# Altium project Tiny817_Xplained_Pro.PrjPCB (part 1 of 2)
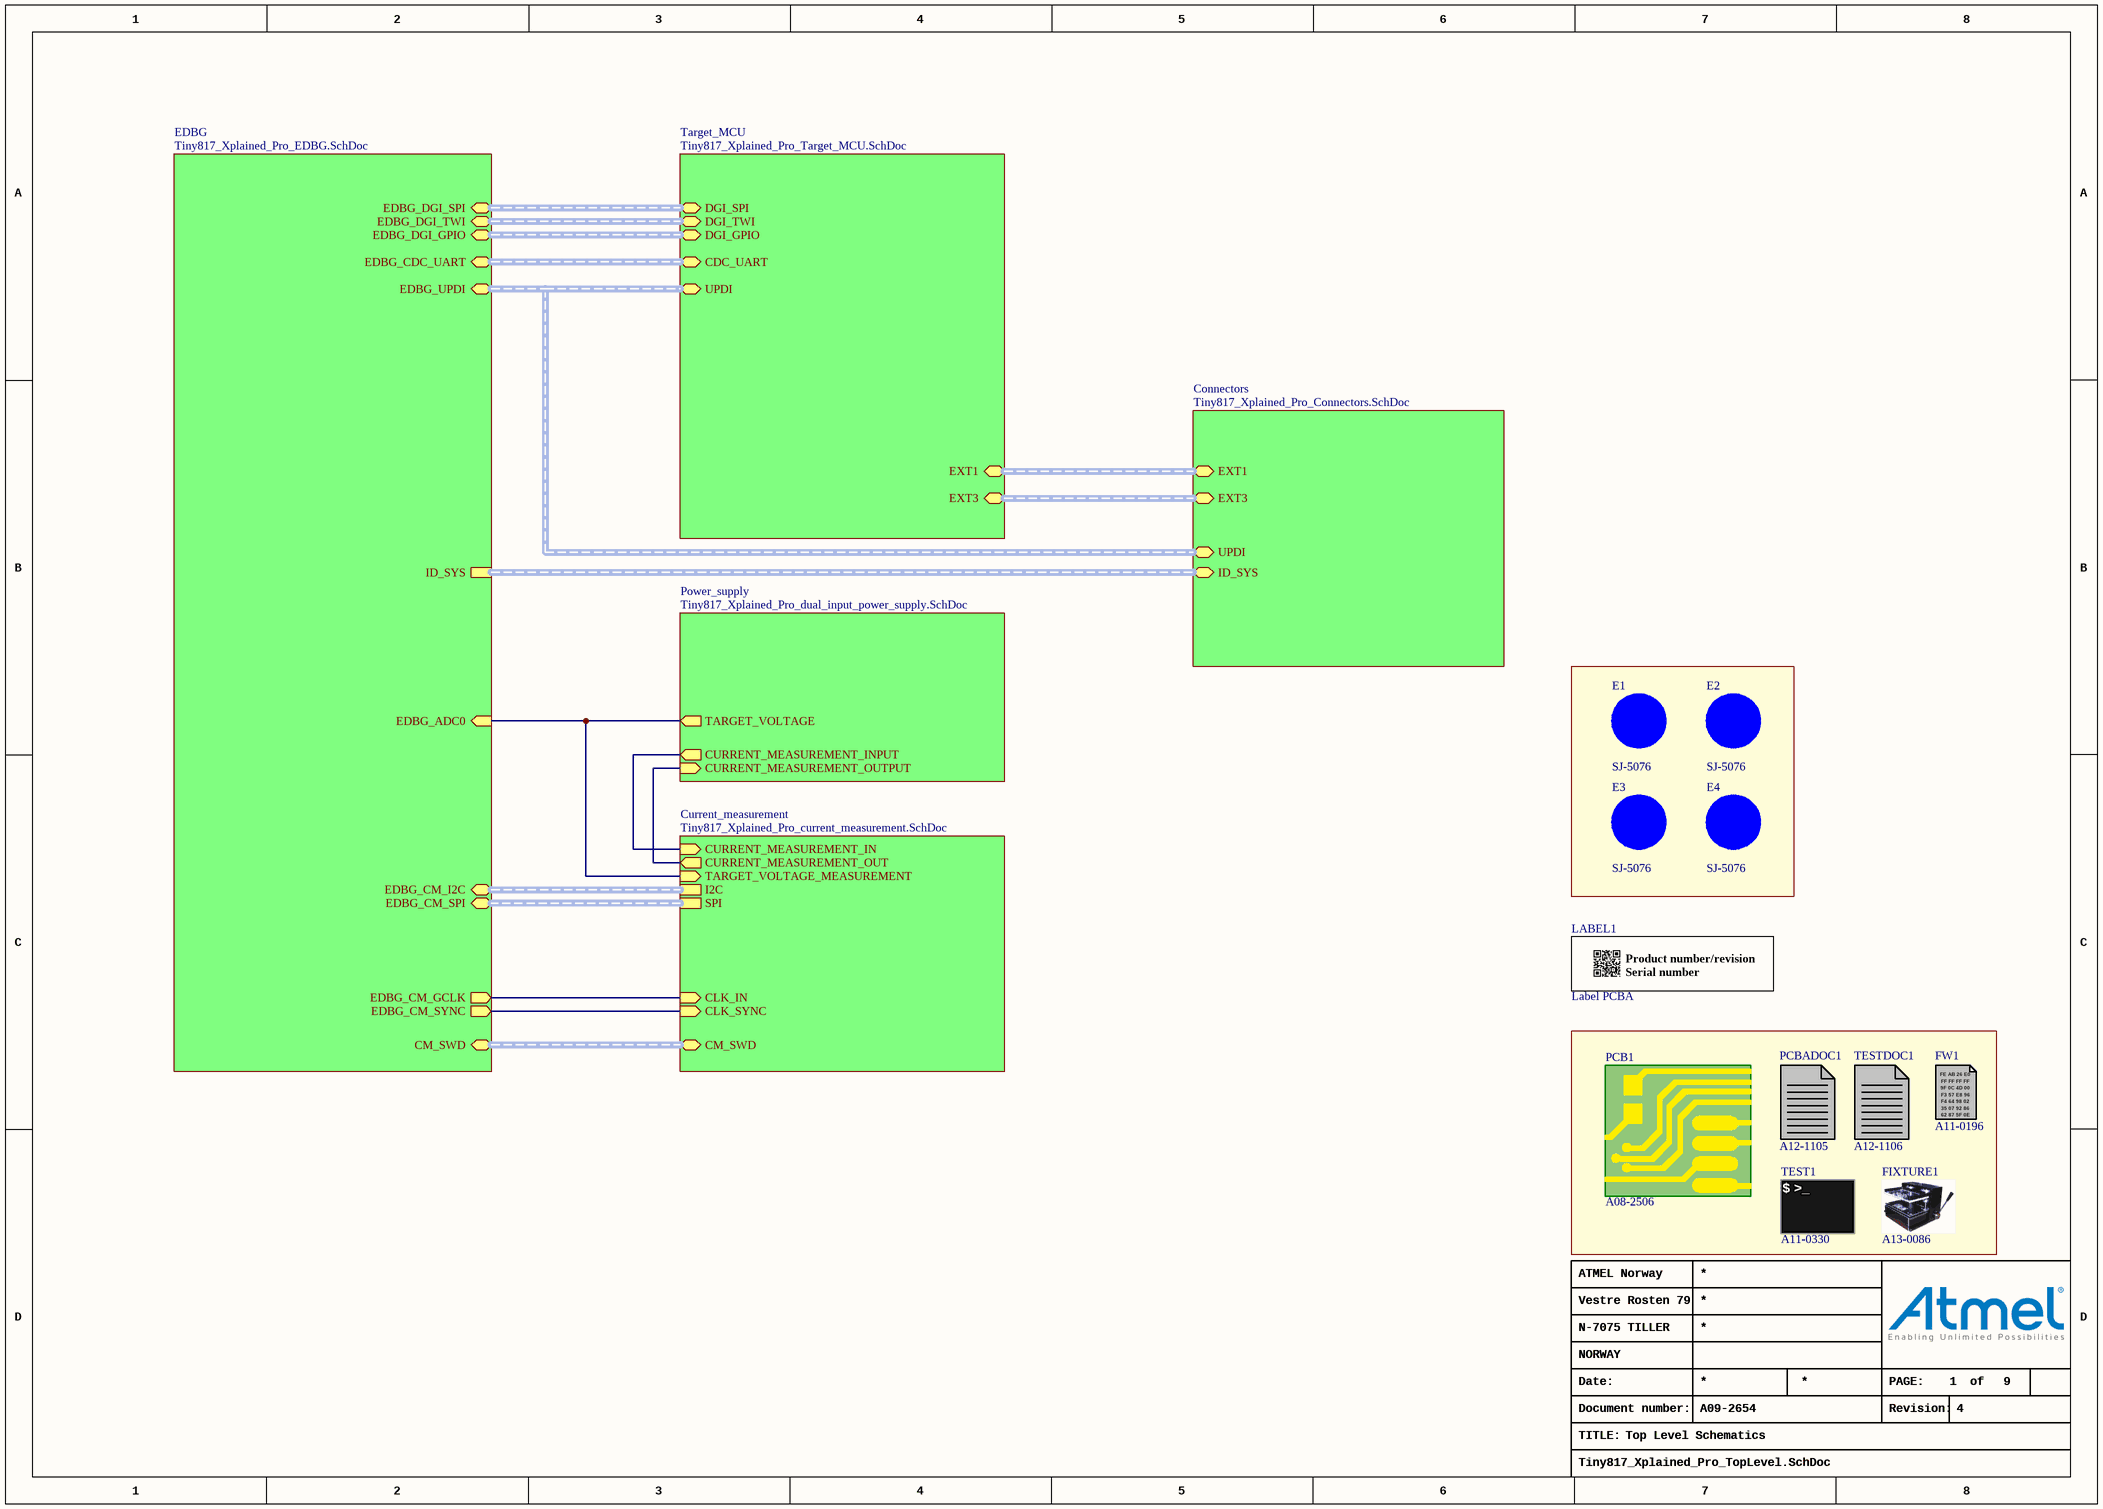
[diagram p0: Tiny817_Xplained_Pro_TopLevel.SchDoc]
9 sheets, 178 parts. Net scope: hierarchical (ports join the sheet entries above them; power ports are global).
Board file: Tiny817_Xplained_Pro.PcbDoc
Sheets:
  Tiny817_Xplained_Pro_TopLevel.SchDoc
    Target_MCU = Tiny817_Xplained_Pro_Target_MCU.SchDoc
    EDBG = Tiny817_Xplained_Pro_EDBG.SchDoc
    Connectors = Tiny817_Xplained_Pro_Connectors.SchDoc
    Power_supply = Tiny817_Xplained_Pro_dual_input_power_supply.SchDoc
    Current_measurement = Tiny817_Xplained_Pro_current_measurement.SchDoc
      Calibration = Tiny817_Xplained_Pro_current_measurement_calibration.SchDoc
      Control = Tiny817_Xplained_Pro_current_measurement_control.SchDoc
      Frontend = Tiny817_Xplained_Pro_current_measurement_frontend.SchDoc

## Sheet Tiny817_Xplained_Pro_TopLevel.SchDoc: Top Level Schematics
size A3; Organization: ATMEL Norway; Address1: Vestre Rosten 79; Address2: N-7075 TILLER; Address3: NORWAY; DocumentNumber: A09-2654; Revision: 4; SheetNumber: 1; SheetTotal: 9; PageSetup: Record=PageOptions|CenterHorizontal=True|CenterVertical=True|PrintScale=1.01|XCorrection=1.00|YCorrection=1.00|PrintKind=1|BorderSize=5000000|LeftOffset=0|BottomOffset=0|Orientation=2|PaperLength=1000|PaperWidth=1000|Scale=100|PaperSource=7|PrintQuality=-4|MediaType=1|DitherType=10|PaperKind=Letter|PrintScaleMode=1

### Parts
E1  value SJ-5076  [AP8-00192]
E2  value SJ-5076  [AP8-00192]
E3  value SJ-5076  [AP8-00192]
E4  value SJ-5076  [AP8-00192]
FIXTURE1  AN: A13-0086  (mechanical)
FW1  AN: A11-0196  (mechanical)
LABEL1  value Label PCBA  [AP8-00317]
PCB1  AN: A08-2506  (mechanical)
PCBADOC1  AN: A12-1105  (mechanical)
TEST1  AN: A11-0330  (mechanical)
TESTDOC1  AN: A12-1106  (mechanical)

### Sub-sheets
Connectors = Tiny817_Xplained_Pro_Connectors.SchDoc: EXT1 (harness EXT), EXT3 (harness EXT), UPDI (harness UPDI), ID_SYS (harness ID_SYS)
Current_measurement = Tiny817_Xplained_Pro_current_measurement.SchDoc: I2C (harness I2C), SPI (harness SPI), CLK_IN (in), CLK_SYNC (in), CURRENT_MEASUREMENT_OUT (out), CURRENT_MEASUREMENT_IN (in), TARGET_VOLTAGE_MEASUREMENT (in), CM_SWD (harness SWD)
EDBG = Tiny817_Xplained_Pro_EDBG.SchDoc: ID_SYS (harness ID_SYS), EDBG_CDC_UART (harness UART), EDBG_DGI_TWI (harness I2C), EDBG_DGI_SPI (harness SPI), EDBG_ADC0 (in), EDBG_CM_I2C (harness I2C), EDBG_CM_SPI (harness SPI), EDBG_CM_GCLK (out), EDBG_CM_SYNC (out), CM_SWD (harness SWD), EDBG_DGI_GPIO (harness GPIO), EDBG_UPDI (harness UPDI)
Power_supply = Tiny817_Xplained_Pro_dual_input_power_supply.SchDoc: TARGET_VOLTAGE (out), CURRENT_MEASUREMENT_INPUT (out), CURRENT_MEASUREMENT_OUTPUT (in)
Target_MCU = Tiny817_Xplained_Pro_Target_MCU.SchDoc: DGI_SPI (harness SPI), DGI_TWI (harness I2C), CDC_UART (harness UART), EXT3 (harness EXT), EXT1 (harness EXT), DGI_GPIO (harness GPIO), UPDI (harness UPDI)

### Nets
CM_PA09_AIN17: sheet EDBG/EDBG_ADC0, sheet Power_supply/TARGET_VOLTAGE, sheet Current_measurement/TARGET_VOLTAGE_MEASUREMENT
CM_PA11_GCLK5: sheet EDBG/EDBG_CM_SYNC, sheet Current_measurement/CLK_SYNC
CM_PA14_GCLK0: sheet EDBG/EDBG_CM_GCLK, sheet Current_measurement/CLK_IN
VCC_CM_IN_P3V3: sheet Power_supply/CURRENT_MEASUREMENT_INPUT, sheet Current_measurement/CURRENT_MEASUREMENT_IN
NetJ101_3: sheet Power_supply/CURRENT_MEASUREMENT_OUTPUT, sheet Current_measurement/CURRENT_MEASUREMENT_OUT

Not connected (* = marked no-connect by the designer): E1 1(FIDUCIAL); E2 1(FIDUCIAL); E3 1(FIDUCIAL); E4 1(FIDUCIAL)

### Buses and harness runs
harness sheet Connectors/EXT1 = sheet Target_MCU/EXT1
harness sheet Connectors/EXT3 = sheet Target_MCU/EXT3
harness sheet Connectors/ID_SYS = sheet EDBG/ID_SYS
harness sheet Connectors/UPDI = sheet EDBG/EDBG_UPDI = sheet Target_MCU/UPDI
harness sheet Current_measurement/CM_SWD = sheet EDBG/CM_SWD
harness sheet Current_measurement/I2C = sheet EDBG/EDBG_CM_I2C
harness sheet Current_measurement/SPI = sheet EDBG/EDBG_CM_SPI
harness sheet EDBG/EDBG_CDC_UART = sheet Target_MCU/CDC_UART
harness sheet EDBG/EDBG_DGI_GPIO = sheet Target_MCU/DGI_GPIO
harness sheet EDBG/EDBG_DGI_SPI = sheet Target_MCU/DGI_SPI
harness sheet EDBG/EDBG_DGI_TWI = sheet Target_MCU/DGI_TWI

### Notes on the sheet
- Date:
- PAGE:
- of
- TITLE:
- Document number:
- Revision:
- (in symbol A09-0611) / Product number/revision / Serial number
- (in symbol A11-0196) FE AB 26 E0; FF FF FF FF; 9F 0C 4D 00; F3 57 E8 96; F4 64 98 02; 35 07 92 86; 62 87 5F 0E
- (in symbol A11-0330) $ >_

### Library data of the parts
E1-E4 = A08-0053: 2.8mm adhesive feet,diam 8.0mm; PartGroup: Mechanical devices,Mounting accessories; Manufacturer: 3M; AN: A08-0053; Height: 2,79999995231628; MPN: SJ-5076
FIXTURE1 = A13-0086: Xplained PRO MCU board Jupiter Test Fixture; PartGroup: Test Equipment,Test Fixtures; Manufacturer: ESCATEC; Value: Xplained PRO MCU board Jupiter Test Fixture; MPN: Xplained PRO MCU board Jupiter Test Fixture
FW1 = A11-0196: EDBG secured firmware; PartGroup: Software,Firmware,Tools; Manufacturer: ATMEL; Value: EDBG secured firmware
LABEL1 = A09-0611: PCBA identification label PP Top White Gloss; PartGroup: Mechanical devices,Packaging materials,Printed Labels; Manufacturer: ACT Logimark AS; MPN: 505462; AN: A09-0611
PCB1 = A08-2506: ATtiny807 Xplained Pro PCB documentation; PartGroup: Mechanical devices,Printed circuit boards; Value: ATtiny817 Xplained Pro PCB documentation
PCBADOC1 = A12-1105: ATtiny807 Xplained Pro PCBA documentation; PartGroup: Documentation,PCBA Documents,Atmel; Value: A09-2654 PCBA Files
TEST1 = A11-0330: Fixture test for ATtiny807 Xplained Pro; PartGroup: Software,Test software,Starter Kit; Value: ATtiny817 Xplained Pro test
TESTDOC1 = A12-1106: ATtiny807 Xplained Pro Test Instructions; PartGroup: Documentation,Procedures,Test Instructions; Value: ATtiny817 Xplained Pro Test Instructions

## Sheet Tiny817_Xplained_Pro_Target_MCU.SchDoc: Target MCU
size A3; Organization: ATMEL Norway; Address1: Vestre Rosten 79; Address2: N-7075 TILLER; Address3: NORWAY; DocumentNumber: A09-2654; Revision: 4; SheetNumber: 2; SheetTotal: 9; PageSetup: Record=PageOptions|CenterHorizontal=True|CenterVertical=True|PrintScale=1.01|XCorrection=1.00|YCorrection=1.00|PrintKind=1|BorderSize=5000000|LeftOffset=0|BottomOffset=0|Orientation=2|PaperLength=1000|PaperWidth=1000|Scale=100|PaperSource=7|PrintQuality=-4|MediaType=1|DitherType=10|PaperKind=A3 (297 x 420 mm)|PrintScaleMode=1
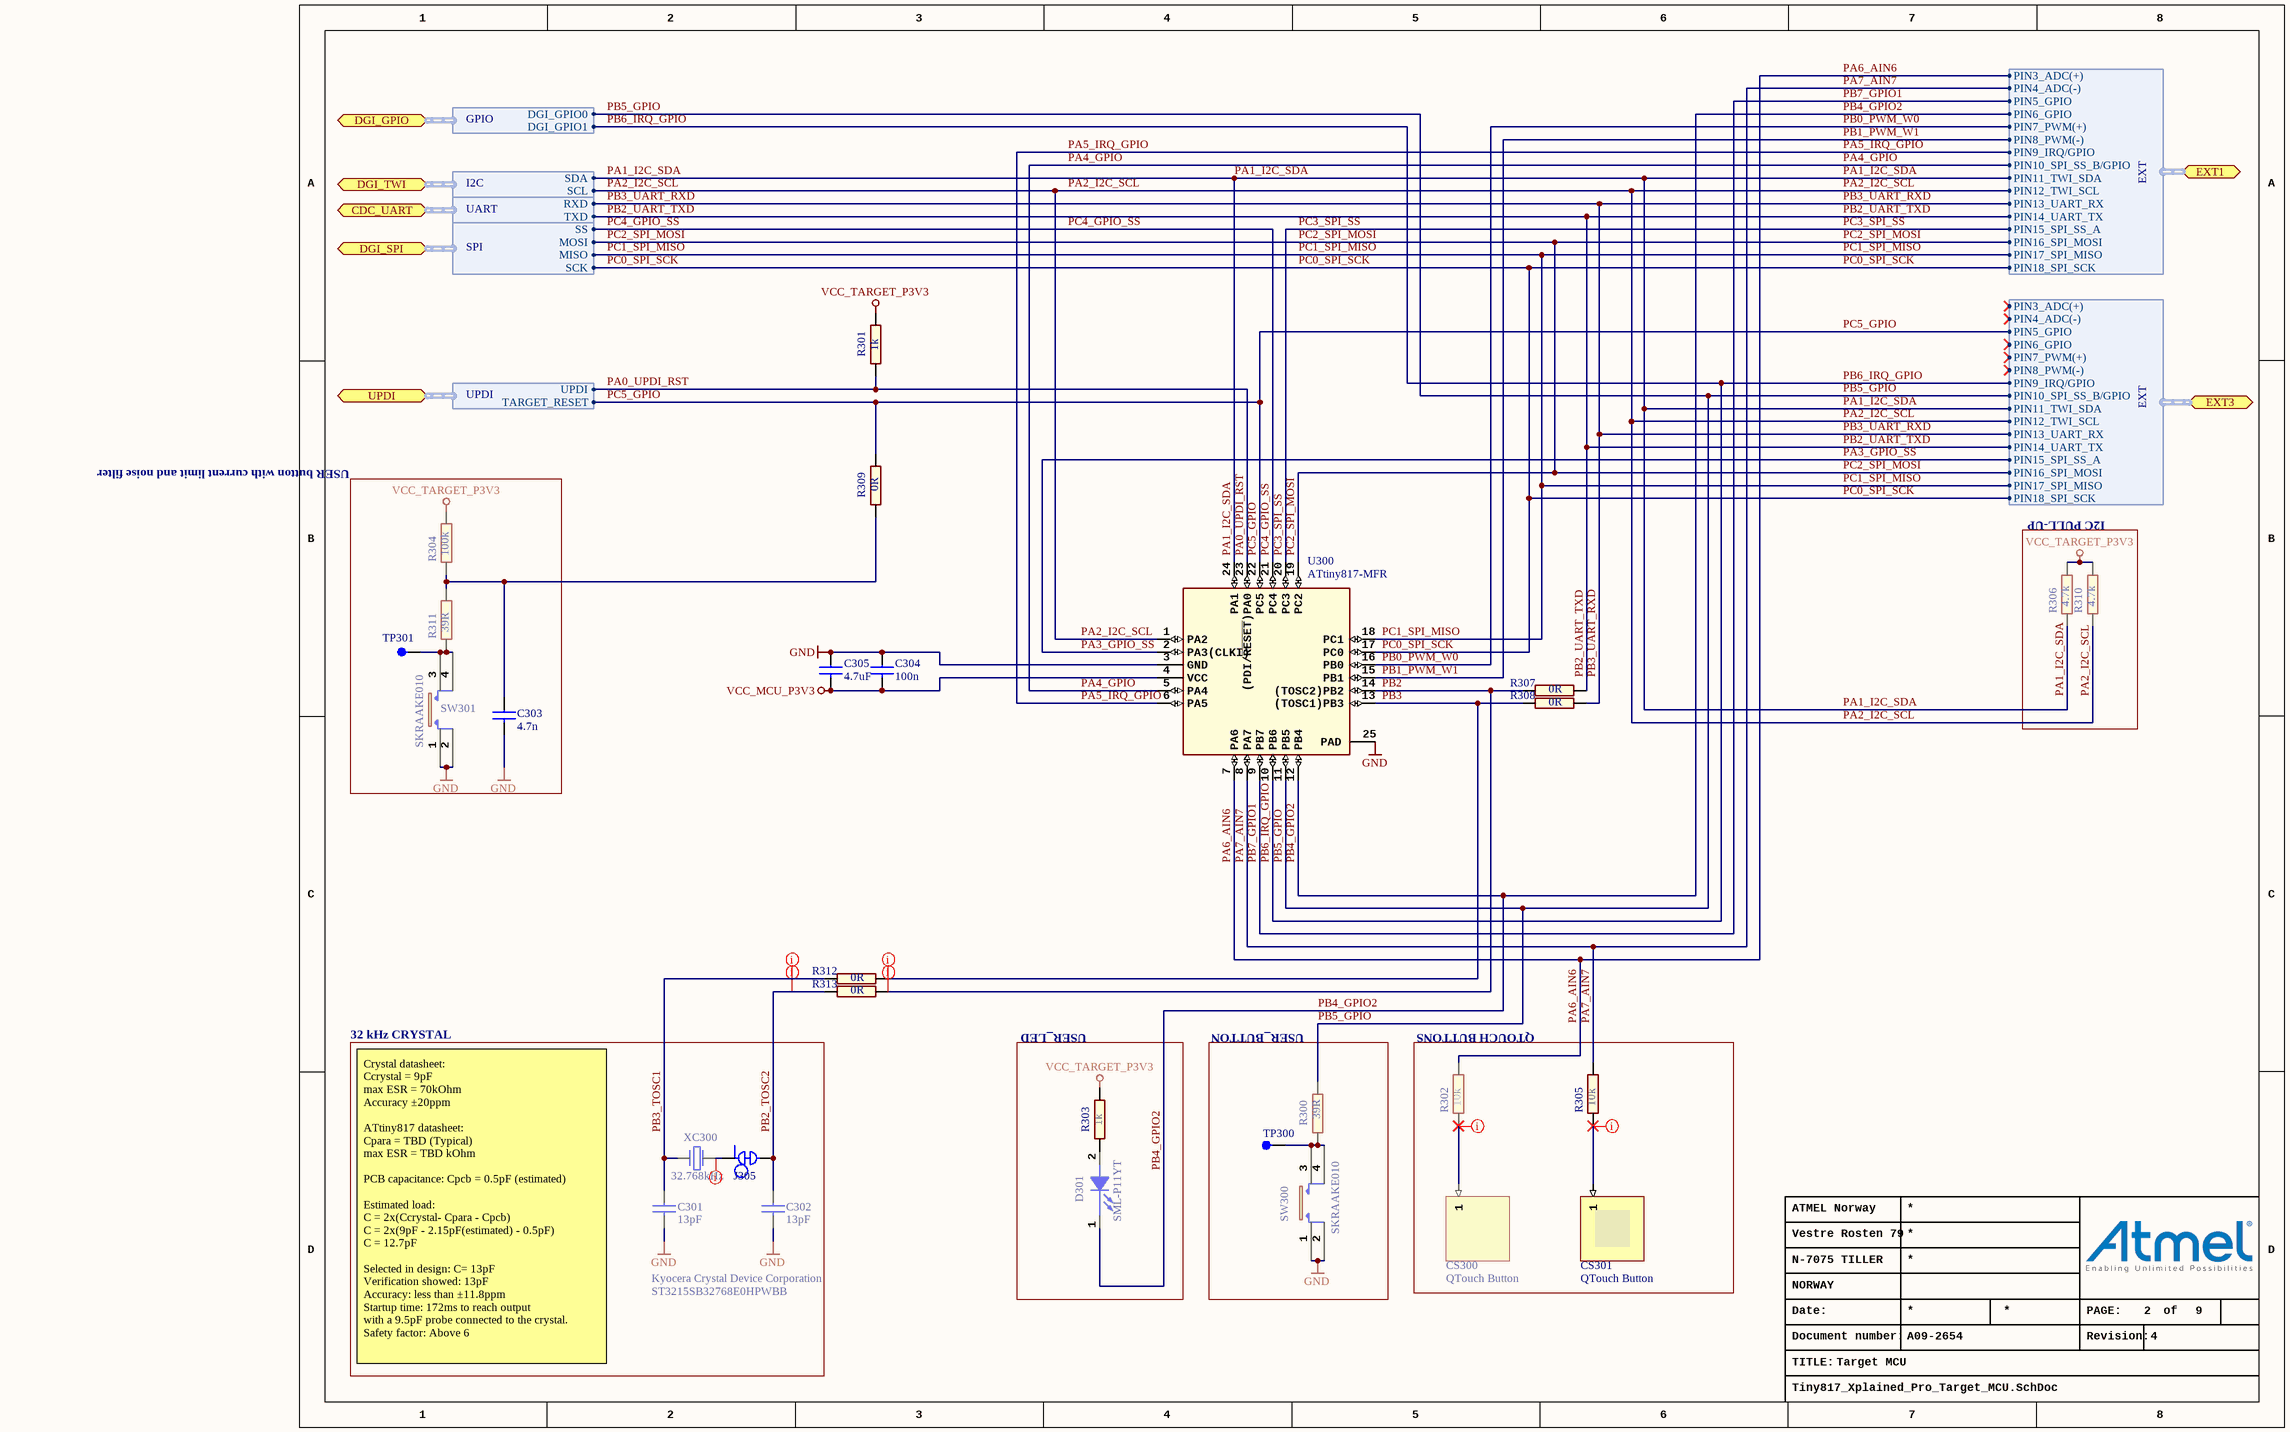
[diagram p1: Tiny817_Xplained_Pro_Target_MCU.SchDoc]

### Parts
C301  value 13pF  [AP1-00053]
C302  value 13pF  [AP1-00053]
C303  value 4.7n  [AP1-00053]
C304  value 100n  [AP1-00053]
C305  value 4.7uF  [AP1-00117]
CS300  QTouch Button  (no BOM)
CS301  QTouch Button  (no BOM)
D301  value SML-P11YT  [AP4-00160]
J305  (no value)  [AP9-00044]  (net tie, no BOM)
R300  value 39R  [AP2-00011]
R301  value 1k  [AP2-00011]
R302  value 10k  [AP2-00011]
R303  value 1k  [AP2-00011]
R304  value 100k  [AP2-00011]
R305  value 10k  [AP2-00011]
R306  value 4.7k  [AP2-00011]
R307  value 0R  [AP2-00011]
R308  value 0R  [AP2-00011]
R309  value 0R  [AP2-00011]
R310  value 4.7k  [AP2-00011]
R311  value 39R  [AP2-00011]
R312  value 0R  [AP2-00011]
R313  value 0R  [AP2-00011]
SW300  value SKRAAKE010  [AP8-00137]
SW301  value SKRAAKE010  [AP8-00137]
TP300  (no value)  [AP8-00010]  (no BOM)
TP301  (no value)  [AP8-00010]  (no BOM)
U300  value ATtiny817-MFR  [AP6-00459]  (hidden comment: ATtiny807)
XC300  value 32.768kHz  Manufacturer: Kyocera Crystal Device Corporation  MPN: ST3215SB32768E0HPWBB  [AP7-00090]

### Blocks framed on the sheet
USER button with current limit and noise filter: C303 R304 R311 SW301 TP301
I2C PULL-UP: R306 R310
32 kHz CRYSTAL: C301 C302 J305 XC300
USER_LED: D301 R303
USER_BUTTON: R300 SW300 TP300
QTOUCH BUTTONS: CS300 CS301 R302 R305

### Ports
CDC_UART (harness UART), DGI_GPIO (harness GPIO), DGI_SPI (harness SPI), DGI_TWI (harness I2C), EXT1 (harness EXT), EXT3 (harness EXT), UPDI (harness UPDI)

### Harnesses
UPDI: UPDI, TARGET_RESET
GPIO: DGI_GPIO0, DGI_GPIO1
SPI: MISO, MOSI, SCK, SS
I2C: SCL, SDA
UART: RXD, TXD
EXT: PIN10_SPI_SS_B/GPIO, PIN11_TWI_SDA, PIN12_TWI_SCL, PIN13_UART_RX, PIN14_UART_TX, PIN15_SPI_SS_A, PIN16_SPI_MOSI, PIN17_SPI_MISO, PIN18_SPI_SCK, PIN3_ADC(+), PIN4_ADC(-), PIN5_GPIO, PIN6_GPIO, PIN7_PWM(+), PIN8_PWM(-), PIN9_IRQ/GPIO

### Nets
GND: C301.2 C302.2 C303.2 C304.1 C305.1 SW300.1 SW300.2 SW301.1 SW301.2 U300.3(GND) U300.25(PAD)
VCC_MCU_P3V3: C304.2 C305.2 U300.4(VCC)
VCC_TARGET_P3V3: R301.2 R303.2 R304.2 R306.2 R310.2
PA0_UPDI_RST: R301.1 U300.23((PDI/~{RESET})PA0) ; port UPDI.UPDI
PA1_I2C_SDA: R306.1 U300.24(PA1) ; port DGI_TWI.SDA, port EXT1.PIN11_TWI_SDA, port EXT3.PIN11_TWI_SDA
PA2_I2C_SCL: R310.1 U300.1(PA2) ; port DGI_TWI.SCL, port EXT1.PIN12_TWI_SCL, port EXT3.PIN12_TWI_SCL
PA3_GPIO_SS: U300.2(PA3(CLKI)) ; port EXT3.PIN15_SPI_SS_A
PA4_GPIO: U300.5(PA4) ; port EXT1.PIN10_SPI_SS_B/GPIO
PA5_IRQ_GPIO: U300.6(PA5) ; port EXT1.PIN9_IRQ/GPIO
PA6_AIN6: R302.2 U300.7(PA6) ; port EXT1.PIN3_ADC(+)
PA7_AIN7: R305.2 U300.8(PA7) ; port EXT1.PIN4_ADC(-)
PB0_PWM_W0: U300.16(PB0) ; port EXT1.PIN7_PWM(+)
PB1_PWM_W1: U300.15(PB1) ; port EXT1.PIN8_PWM(-)
PB2: R307.2 R313.1 U300.14((TOSC2)PB2)
PB2_TOSC2: C302.1 J305.2 R313.2
PB2_UART_TXD: R307.1 ; port CDC_UART.TXD, port EXT1.PIN14_UART_TX, port EXT3.PIN14_UART_TX
PB3: R308.2 R312.1 U300.13((TOSC1)PB3)
PB3_TOSC1: C301.1 R312.2 XC300.2
PB3_UART_RXD: R308.1 ; port CDC_UART.RXD, port EXT1.PIN13_UART_RX, port EXT3.PIN13_UART_RX
PB4_GPIO2: D301.1(CATHODE) U300.12(PB4) ; port EXT1.PIN6_GPIO
PB5_GPIO: R300.2 U300.11(PB5) ; port DGI_GPIO.DGI_GPIO0, port EXT3.PIN10_SPI_SS_B/GPIO
PB6_IRQ_GPIO: U300.10(PB6) ; port DGI_GPIO.DGI_GPIO1, port EXT3.PIN9_IRQ/GPIO
PB7_GPIO1: U300.9(PB7) ; port EXT1.PIN5_GPIO
PC0_SPI_SCK: U300.17(PC0) ; port DGI_SPI.SCK, port EXT1.PIN18_SPI_SCK, port EXT3.PIN18_SPI_SCK
PC1_SPI_MISO: U300.18(PC1) ; port DGI_SPI.MISO, port EXT1.PIN17_SPI_MISO, port EXT3.PIN17_SPI_MISO
PC2_SPI_MOSI: U300.19(PC2) ; port DGI_SPI.MOSI, port EXT1.PIN16_SPI_MOSI, port EXT3.PIN16_SPI_MOSI
PC3_SPI_SS: U300.20(PC3) ; port EXT1.PIN15_SPI_SS_A
PC4_GPIO_SS: U300.21(PC4) ; port DGI_SPI.SS
PC5_GPIO: R309.1 U300.22(PC5) ; port UPDI.TARGET_RESET, port EXT3.PIN5_GPIO
NetC303_1: C303.1 R304.1 R309.2 R311.2
NetCS300_1: CS300.1 R302.1
NetCS301_1: CS301.1 R305.1
NetD301_2: D301.2(ANODE) R303.1
NetJ305_1: J305.1 XC300.1
NetR300_1: R300.1 SW300.3 SW300.4 TP300.1
NetR311_1: R311.1 SW301.3 SW301.4 TP301.1

### Layout directives
rule Assembly Testpoint Usage [Testpoint - Not Allowed    Multiple - Not Allowed]: NetCS300_1, NetCS301_1, NetJ305_1, PB2, PB2_TOSC2, PB3, PB3_TOSC1

### Notes on the sheet
- Crystal datasheet:
  Ccrystal = 9pF
  max ESR = 70kOhm
  Accuracy ±20ppm
  ATtiny817 datasheet:
  Cpara = TBD (Typical)
  max ESR = TBD kOhm
  PCB capacitance: Cpcb = 0.5pF (estimated)
  Estimated load:
  C = 2x(Ccrystal- Cpara - Cpcb)
  C = 2x(9pF - 2.15pF(estimated) - 0.5pF)
  C = 12.7pF
  Selected in design: C= 13pF
  Verification showed: 13pF
  Accuracy: less than ±11.8ppm
  Startup time: 172ms to reach output
  with a 9.5pF probe connected to the crystal.
  Safety factor: Above 6
- Date:
- PAGE:
- of
- TITLE:
- Document number:
- Revision:

### Library data of the parts
C301 C302 = A01-0793: Ceramic capacitor, SMD 0402, NP0, 50V, +/-5%; PartGroup: Capacitors,Ceramic,SMD 0402; Manufacturer: Murata; MPN: GRM1555C1H130JA01D; Tolerance: 5%; TemperatureRange: -55 - +125 deg C; AN: A01-0793
C303 = A01-0046: Ceramic capacitor, SMD 0402, X7R, 25V, +/-10% (de35287); PartGroup: Capacitors,Ceramic,SMD 0402; Manufacturer: PHYCOMP; MPN: 2238 587 15632; TemperatureRange: -55 - +125 deg C; AN: A01-0046; Tolerance: 25V, +/-10%; Height: 0,550000011920929
C304 = A01-0246: Ceramic capacitor, SMD 0402, X7R, 16V, +/-10%; PartGroup: Capacitors,Ceramic,SMD 0402; Manufacturer: Kemet; MPN: C0402C104K4RACTU; TemperatureRange: -55 - +125 deg C; AN: A01-0246; Tolerance: 16V, +/-10%; Height: 0,5
C305 = A01-0377: Ceramic capacitor, SMD 0603, X5R, 10V, 10% (de31036); PartGroup: Capacitors,Ceramic,SMD 0603; Manufacturer: WALSIN Technology Corporation; MPN: 0603X475K100CT; TemperatureRange: -55 - +85 deg C; AN: A01-0377; Tolerance: 10%; Height: 0,800000011920929
CS300 CS301 = QTouchButton: ConfiguratorName: ATMEL_TOUCH; ConfigurationParameters: {}__sensorid[1]{}width[8]{}height[8]{}
D301 = A10-0182: LED, SMD 0402, Yellow, Wave length=586nm, 7.6mcd @ (1mA, 1.9Vf); PartGroup: Opto,LEDs,SMD; Manufacturer: ROHM; MPN: SML-P11YT-T86; TemperatureRange: -40 to +85; AN: A10-0182; Height: 0,200000002980232
J305 = A09-0783: Default closed SMD strap, 0603 size; PartGroup: Mechanical devices,PCB implemented components; Value: SMD-STRAP_0603_CLOSED; AN: A09-0783; Height: 0
R300 R311 = A02-0178: Thick film resistor, SMD 0402, 1/16W, 1%; PartGroup: Resistors,SMD,0402 1%; Manufacturer: ASJ; MPN: CR10-39R0-FK; TemperatureRange: -55 - +125 deg C; AN: A02-0178; Tolerance: 1 %; Height: 0,349999994039536
R301 R303 = A02-0212: Thick film resistor, SMD 0402, 1/16W, 1%; PartGroup: Resistors,SMD,0402 1%; Manufacturer: ASJ; MPN: CR10-1001-FK; TemperatureRange: -55 - +125 deg C; AN: A02-0212; Tolerance: 1 %; Height: 0,349999994039536
R302 R305 = A02-0236: Thick film resistor, SMD 0402, 1/16W, 1%; PartGroup: Resistors,SMD,0402 1%; Manufacturer: vishay; MPN: CRCW040210K0FKED; TemperatureRange: -55 - +125 deg C; AN: A02-0236; Tolerance: 1 %; Height: 0,349999994039536
R304 = A02-0260: Thick film resistor, SMD 0402, 1/16W, 1%; PartGroup: Resistors,SMD,0402 1%; Manufacturer: ASJ; MPN: CR10-1003-FK; TemperatureRange: -55ï¿½ to +125ï¿½C; AN: A02-0260; Tolerance: 1 %; Height: 0,349999994039536
R306 R310 = A02-0228: Thick film resistor, SMD 0402, 1/16W, 1%; PartGroup: Resistors,SMD,0402 1%; Manufacturer: PHYCOMP; MPN: 2322 706 74702L; TemperatureRange: -55ï¿½ to +125ï¿½C; AN: A02-0228; Tolerance: 1 %; Height: 0,349999994039536
R307-R309 R312 R313 = A02-0163: RES 0.0 OHM 1/16W 0402 SMD; PartGroup: Resistors,SMD,0402 1%; Manufacturer: (n/a); MPN: RMCF0402ZT0R00; Tolerance: 1 %; TemperatureRange: -55 - +125 deg C; AN: A02-0163; Height: 0,349999994039536
SW300 SW301 = A08-0790: 6.2x6.2 mm SMD tact switch, same as A08-0091 but less force is needed; PartGroup: Mechanical devices,Switches,SMD; Manufacturer: ALPS; TemperatureRange: -30 - +90 deg C; AN: A08-0790; Height: 5,09999990463257; MPN: SKRAAKE010
TP300 TP301 = A08-0004: Single SMD testpad; PartGroup: Mechanical devices,Connectors,Test points; AN: A08-0004; Value: TESTPAD; Height: 0
U300 = A06-1373: Atmel 8-bit RISC MCU; PartGroup: Integrated Circuits,MCU, MPU, DSP,AVR MCU; TemperatureRange: -40Â°C +125Â°C; ComponentStatus: 'Active (verified)'; AN: A06-1373; Height: 0,899999976158142; Manufacturer: ATMEL; MPN: ATTINY817-MFR; FootprintStatus: 'Active (Verified)'
XC300 = A07-0129: Kyocera ST3215SB32768E0HPWBB, 32.768kHz, 9pF, SMD tuning fork crystal; PartGroup: Frequency devices,Crystals,SMD; Tolerance: Â±20ppm; TemperatureRange: -40Â°C to +85Â°C; AN: A07-0129; Height: 0,800000011920929

## Sheet Tiny817_Xplained_Pro_EDBG.SchDoc: Embedded Debugger (EDBG)
size A3; Organization: ATMEL Norway; Address1: Vestre Rosten 79; Address2: N-7075 TILLER; Address3: NORWAY; DocumentNumber: A09-2654; Revision: 4; SheetNumber: 9; SheetTotal: 9; PageSetup: Record=PageOptions|CenterHorizontal=True|CenterVertical=True|PrintScale=0.73|XCorrection=1.00|YCorrection=1.00|PrintKind=1|BorderSize=5000000|LeftOffset=0|BottomOffset=0|Orientation=2|PaperLength=1000|PaperWidth=1000|Scale=100|PaperSource=7|PrintQuality=-4|MediaType=1|DitherType=10|PaperKind=A3 (297 x 420 mm)|PrintScaleMode=1
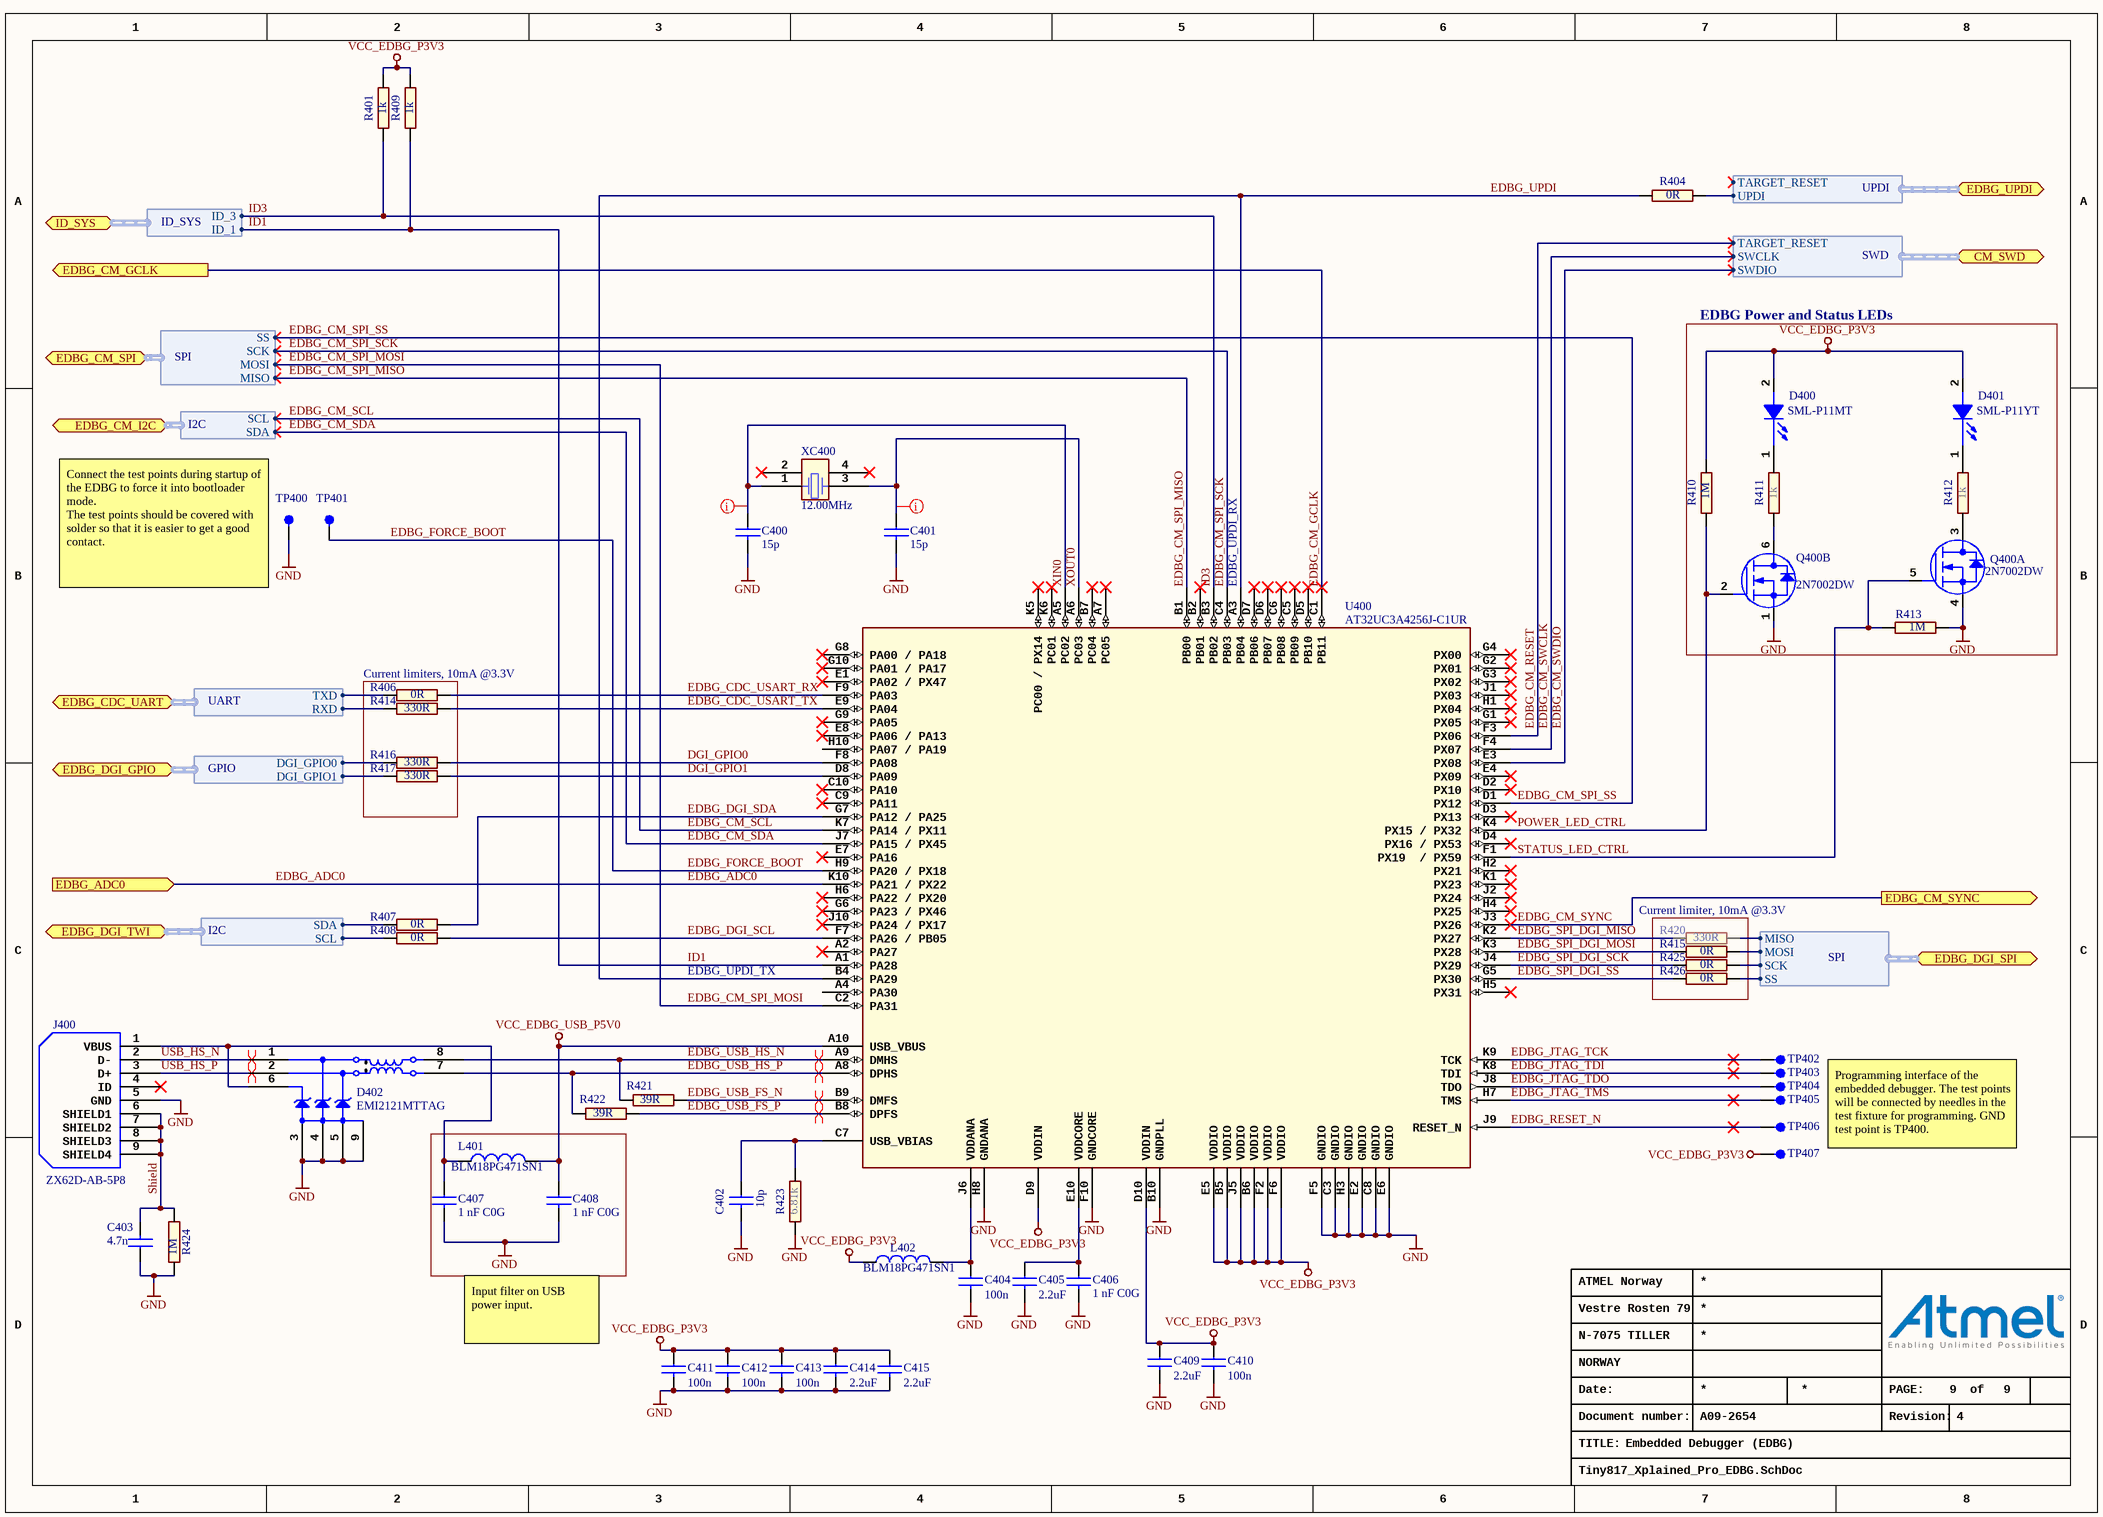
[diagram p2: Tiny817_Xplained_Pro_EDBG.SchDoc]

### Parts
C400  value 15p  [AP1-00053]
C401  value 15p  [AP1-00053]
C402  value 10p  [AP1-00053]
C403  value 4.7n  [AP1-00053]
C404  value 100n  [AP1-00053]
C405  value 2.2uF  [AP1-00053]  (hidden comment: Farnell no: 1288200)
C406  value 1 nF C0G  [AP1-00053]
C407  value 1 nF C0G  [AP1-00053]
C408  value 1 nF C0G  [AP1-00053]
C409  value 2.2uF  [AP1-00053]  (hidden comment: Farnell no: 1288200)
C410  value 100n  [AP1-00053]
C411  value 100n  [AP1-00053]
C412  value 100n  [AP1-00053]
C413  value 100n  [AP1-00053]
C414  value 2.2uF  [AP1-00053]  (hidden comment: Farnell no: 1288200)
C415  value 2.2uF  [AP1-00053]  (hidden comment: Farnell no: 1288200)
D400  value SML-P11MT  [AP4-00160]
D401  value SML-P11YT  [AP4-00160]
D402  value EMI2121MTTAG  [AP4-00159]
J400  value ZX62D-AB-5P8  [AP8-00852]  (hidden comment: 2,000 pieces per reel)
L401  value BLM18PG471SN1  [AP3-00005]
L402  value BLM18PG471SN1  [AP3-00005]
Q400  value 2N7002DW  [AP5-00001]  (hidden comment: Same as 2N7002 but with two MOSFETs in one package)  (parts A,B of 2)
R401  value 1k  [AP2-00000]
R404  value 0R  [AP2-00000]
R406  value 0R  [AP2-00000]
R407  value 0R  [AP2-00000]
R408  value 0R  [AP2-00000]
R409  value 1k  [AP2-00000]
R410  value 1M  [AP2-00011]
R411  value 1k  [AP2-00011]
R412  value 1k  [AP2-00011]
R413  value 1M  [AP2-00011]
R414  value 330R  [AP2-00000]
R415  value 0R  [AP2-00000]
R416  value 330R  [AP2-00000]
R417  value 330R  [AP2-00000]
R420  value 330R  [AP2-00000]
R421  value 39R  [AP2-00011]
R422  value 39R  [AP2-00011]
R423  value 6.81k  [AP2-00011]
R424  value 1M  [AP2-00011]
R425  value 0R  [AP2-00000]
R426  value 0R  [AP2-00000]
TP400  (no value)  [AP8-00010]  (no BOM)
TP401  (no value)  [AP8-00010]  (no BOM)
TP402  (no value)  [AP8-00010]  (no BOM)
TP403  (no value)  [AP8-00010]  (no BOM)
TP404  (no value)  [AP8-00010]  (no BOM)
TP405  (no value)  [AP8-00010]  (no BOM)
TP406  (no value)  [AP8-00010]  (no BOM)
TP407  (no value)  [AP8-00010]  (no BOM)
U400  value AT32UC3A4256J-C1UR  [AP6-00206]  (hidden comment: 100 ball VFBGA)
XC400  value 12.00MHz  [AP7-00089]

### Blocks framed on the sheet
EDBG Power and Status LEDs: D400 D401 Q400 R410-R413
Current limiters, 10mA @3.3V: R406 R414 R416 R417

### Ports
CM_SWD (harness SWD), EDBG_ADC0 (in), EDBG_CDC_UART (harness UART), EDBG_CM_GCLK (out), EDBG_CM_I2C (harness I2C), EDBG_CM_SPI (harness SPI), EDBG_CM_SYNC (out), EDBG_DGI_GPIO (harness GPIO), EDBG_DGI_SPI (harness SPI), EDBG_DGI_TWI (harness I2C), EDBG_UPDI (harness UPDI), ID_SYS (harness ID_SYS)

### Harnesses
UART: TXD, RXD
SPI: MISO, MOSI, SCK, SS
GPIO: DGI_GPIO0, DGI_GPIO1
ID_SYS: ID_1, ID_3
I2C: SCL, SDA
SWD: SWCLK, SWDIO, TARGET_RESET
UPDI: TARGET_RESET, UPDI

### Nets
GND: C400.2 C401.2 C402.2 C403.1 C404.2 C405.2 C406.2 C407.2 C408.2 C409.2 C410.2 C411.2 C412.2 C413.2 C414.2 C415.2 D402.3(GND) D402.4(GND) D402.5(GND) D402.9(GND) J400.5(GND) Q400.1(S2) Q400.4(S1) R413.1 R423.1 R424.1 TP400.1 U400.B10(GNDPLL) U400.C3(GNDIO) U400.C8(GNDIO) U400.E2(GNDIO) U400.E6(GNDIO) U400.F5(GNDIO) U400.F10(GNDCORE) U400.H3(GNDIO) U400.H8(GNDANA)
VCC_EDBG_P3V3: C409.1 C410.1 C411.1 C412.1 C413.1 C414.1 C415.1 D400.2(ANODE) D401.2(ANODE) L402.1 R401.2 R409.2 R410.2 TP407.1 U400.B5(VDDIO) U400.B6(VDDIO) U400.D9(VDDIN) U400.D10(VDDIN) U400.E5(VDDIO) U400.F2(VDDIO) U400.F6(VDDIO) U400.J5(VDDIO)
VCC_EDBG_USB_P5V0: C408.1 L401.2 U400.A10(USB_VBUS)
DGI_GPIO0: R416.2 U400.F8(PA08)
DGI_GPIO1: R417.2 U400.D8(PA09)
EDBG_ADC0: U400.K10(PA21_/_PX22) ; port EDBG_ADC0  [project net CM_PA09_AIN17]
EDBG_CDC_USART_RX: R406.1 U400.F9(PA03)
EDBG_CDC_USART_TX: R414.2 U400.E9(PA04)
EDBG_CM_GCLK: U400.C1(PB11) ; port EDBG_CM_GCLK  [project net CM_PA14_GCLK0]
EDBG_CM_RESET: U400.F3(PX06) ; port CM_SWD.TARGET_RESET  [project net CM_RESET_N]
EDBG_CM_SCL: U400.K7(PA14_/_PX11) ; port EDBG_CM_I2C.SCL  [project net CM_PA17_SERCOM1_SCL]
EDBG_CM_SDA: U400.J7(PA15_/_PX45) ; port EDBG_CM_I2C.SDA  [project net CM_PA16_SERCOM1_SDA]
EDBG_CM_SPI_MISO: U400.B1(PB00) ; port EDBG_CM_SPI.MISO  [project net CM_PA24_SERCOM3_PAD2_SPI_MISO]
EDBG_CM_SPI_MOSI: U400.C2(PA31) ; port EDBG_CM_SPI.MOSI  [project net CM_PA22_SERCOM3_PAD0_SPI_MOSI]
EDBG_CM_SPI_SCK: U400.C4(PB03) ; port EDBG_CM_SPI.SCK  [project net CM_PA23_SERCOM3_PAD1_SPI_SCK]
EDBG_CM_SPI_SS: U400.D1(PX12) ; port EDBG_CM_SPI.SS  [project net CM_PA25_SPI_SS]
EDBG_CM_SWCLK: U400.F4(PX07) ; port CM_SWD.SWCLK  [project net CM_PA30_SWCLK]
EDBG_CM_SWDIO: U400.E3(PX08) ; port CM_SWD.SWDIO  [project net CM_PA31_SWDIO]
EDBG_CM_SYNC: U400.J3(PX26) ; port EDBG_CM_SYNC  [project net CM_PA11_GCLK5]
EDBG_DGI_SCL: R408.1 U400.F7(PA26_/_PB05)
EDBG_DGI_SDA: R407.1 U400.G7(PA12_/_PA25)
EDBG_FORCE_BOOT: TP401.1 U400.H9(PA20_/_PX18)
EDBG_JTAG_TCK: TP402.1 U400.K9(TCK)
EDBG_JTAG_TDI: TP403.1 U400.K8(TDI)
EDBG_JTAG_TDO: TP404.1 U400.J8(TDO)
EDBG_JTAG_TMS: TP405.1 U400.H7(TMS)
EDBG_RESET_N: TP406.1 U400.J9(RESET_N)
EDBG_SPI_DGI_MISO: R420.1 U400.K2(PX27)
EDBG_SPI_DGI_MOSI: R415.2 U400.K3(PX28)
EDBG_SPI_DGI_SCK: R425.2 U400.J4(PX29)
EDBG_SPI_DGI_SS: R426.2 U400.G5(PX30)
EDBG_UPDI: R404.2 U400.A3(PB04) U400.B4(PA29)
EDBG_USB_FS_N: R421.2 U400.B9(DMFS)
EDBG_USB_FS_P: R422.2 U400.B8(DPFS)
EDBG_USB_HS_N: D402.8(DIFF1_INT) R421.1 U400.A9(DMHS)
EDBG_USB_HS_P: D402.7(DIFF2_INT) R422.1 U400.A8(DPHS)
ID1: R409.1 U400.A1(PA28) ; port ID_SYS.ID_1
ID3: R401.1 U400.B3(PB02) ; port ID_SYS.ID_3
PA0_UPDI_RST: R404.1 ; port EDBG_UPDI.UPDI
PA1_I2C_SDA: R407.2 ; port EDBG_DGI_TWI.SDA
PA2_I2C_SCL: R408.2 ; port EDBG_DGI_TWI.SCL
PB2_UART_TXD: R406.2 ; port EDBG_CDC_UART.TXD
PB3_UART_RXD: R414.1 ; port EDBG_CDC_UART.RXD
PB5_GPIO: R416.1 ; port EDBG_DGI_GPIO.DGI_GPIO0
PB6_IRQ_GPIO: R417.1 ; port EDBG_DGI_GPIO.DGI_GPIO1
PC0_SPI_SCK: R425.1 ; port EDBG_DGI_SPI.SCK
PC1_SPI_MISO: R420.2 ; port EDBG_DGI_SPI.MISO
PC2_SPI_MOSI: R415.1 ; port EDBG_DGI_SPI.MOSI
PC4_GPIO_SS: R426.1 ; port EDBG_DGI_SPI.SS
POWER_LED_CTRL: Q400.2(G2) R410.1 U400.K4(PX15_/_PX32)
Shield: C403.2 J400.6(SHIELD1) J400.7(SHIELD2) J400.8(SHIELD3) J400.9(SHIELD4) R424.2
STATUS_LED_CTRL: Q400.5(G1) R413.2 U400.F1(PX19__/_PX59)
USB_HS_N: D402.1(DIFF1_EXT) J400.2(D-)
USB_HS_P: D402.2(DIFF2_EXT) J400.3(D+)
XIN0: C400.1 U400.A5(PC02) XC400.1
XOUT0: C401.1 U400.A6(PC03) XC400.3
NetC402_1: C402.1 R423.2 U400.C7(USB_VBIAS)
NetC404_1: C404.1 L402.2 U400.J6(VDDANA)
NetC405_1: C405.1 C406.1 U400.E10(VDDCORE)
NetC407_1: C407.1 D402.6(VBUS) J400.1(VBUS) L401.1
NetD400_1: D400.1(CATHODE) R411.2
NetD401_1: D401.1(CATHODE) R412.2
NetQ400_3: Q400.3(D1) R412.1
NetQ400_6: Q400.6(D2) R411.1

Not connected (* = marked no-connect by the designer): J400 4(ID)*; U400 A2(PA27)* A4(PA30) A7(PC05)* B2(PB01)* B7(PC04)* C5(PB09)* C6(PB08)* C9(PA11)* C10(PA10)* D2(PX10)* D3(PX13)* D4(PX16_/_PX53)* D5(PB10)* D6(PB07)* D7(PB06)* E1(PA02_/_PX47)* E4(PX09)* E7(PA16)* E8(PA06_/_PA13)* G1(PX05)* G2(PX01)* G3(PX02)* G4(PX00)* G6(PA23_/_PX46)* G8(PA00_/_PA18)* G9(PA05)* G10(PA01_/_PA17)* H1(PX04)* H2(PX21)* H4(PX25)* H5(PX31)* H6(PA22_/_PX20)* H10(PA07_/_PA19) J1(PX03)* J2(PX24)* J10(PA24_/_PX17)* K1(PX23)* K5(PC00_/_PX14)* K6(PC01)*; XC400 2* 4*

### Layout directives
differential pair; rule Assembly Testpoint Usage [Testpoint - Not Allowed    Multiple - Not Allowed]: EDBG_USB_FS_N, EDBG_USB_FS_P, EDBG_USB_HS_N, EDBG_USB_HS_P, USB_HS_N, USB_HS_P
rule Assembly Testpoint Usage [Testpoint - Not Allowed    Multiple - Not Allowed]: XIN0, XOUT0

### Notes on the sheet
- (near TP400) Connect the test points during startup of the EDBG to force it into bootloader mode.
  The test points should be covered with solder so that it is easier to get a good contact.
- (near U400) EDBG_UPDI_RX
- Current limiter, 10mA @3.3V
- EDBG_UPDI_TX
- Programming interface of the embedded debugger. The test points will be connected by needles in the test fixture for programming. GND test point is TP400.
- Input filter on USB power input.
- Date:
- PAGE:
- of
- TITLE:
- Document number:
- Revision:

### Library data of the parts
C400 C401 = A01-0017: Ceramic capacitor, SMD 0402, NP0, 50V, +/-5%; PartGroup: Capacitors,Ceramic,SMD 0402; Manufacturer: AVX; MPN: 04025A150JAT2A; TemperatureRange: -55 - +125 deg C; AN: A01-0017; Height: 0,550000011920929; Tolerance: 50V, +/-5%
C402 = A01-0015: Ceramic capacitor, SMD 0402, NP0, 50V, +/-5%; PartGroup: Capacitors,Ceramic,SMD 0402; Manufacturer: AVX; MPN: 04025A100JAT2A; TemperatureRange: -55 - +125 deg C; AN: A01-0015; Tolerance: 50V, +/-5%; Height: 0,550000011920929
C403 = A01-0046: Ceramic capacitor, SMD 0402, X7R, 25V, +/-10%; PartGroup: Capacitors,Ceramic,SMD 0402; Manufacturer: PHYCOMP; MPN: 2238 587 15632; TemperatureRange: -55 - +125 deg C; AN: A01-0046; Tolerance: 25V, +/-10%; Height: 0,550000011920929
C404 C410-C413 = A01-0246: as C304 on sheet Tiny817_Xplained_Pro_Target_MCU; AN: A01-0246; Tolerance: 16V, +/-10%; Height: 0,5
C405 C409 C414 C415 = A01-0300: Ceramic capacitor, SMD 0402, X5R, 6.3V, +/-20%; PartGroup: Capacitors,Ceramic,SMD 0402; Manufacturer: Kemet; MPN: C0402C225M9PAC; Tolerance: Â±20%; TemperatureRange: -55Â°C to +85Â°C; AN: A01-0300; Height: 0,5
C406-C408 = A01-0321: Ceramic capacitor, SMD 0402, C0G, 50V, +/-5%; PartGroup: Capacitors,Ceramic,SMD 0402; Manufacturer: Murata; MPN: GRM1555C1H102JA01D; Tolerance: 5%; AN: A01-0321; Height: 0,550000011920929
D400 = A10-0183: LED, SMD 0402, Green, Wave length=569nm, 2.1mcd @ (1mA, 1.9Vf); PartGroup: Opto,LEDs,SMD; Manufacturer: ROHM; MPN: SML-P11MT-T86; TemperatureRange: -40 to +85; AN: A10-0183; Height: 0,200000002980232
D401 = A10-0182: as D301 on sheet Tiny817_Xplained_Pro_Target_MCU; AN: A10-0182; Height: 0,200000002980232
D402 = A04-0195: EMI2121, SZEMI2121 Single Pair Common Mode Filter with ESD Protection; PartGroup: Diodes,Transient suppression; Manufacturer: ON Semiconductor; TemperatureRange: âˆ’40 to +85 Â°C; AN: A04-0195; Height: 0,800000011920929; MPN: EMI2121MTTAG
J400 = A08-2112: Micro USB AB Connector, Standard SMT + DIP; PartGroup: Mechanical devices,Connectors,USB; Manufacturer: HIROSE; MPN: ZX62D-AB-5P8(30); AN: A08-2112; Height: 2,79999995231628
L401 L402 = A03-0035: SMD RF inductor 0603. Z=470Ohm (@100MHz), Max R(dc)=0.65Ohm, Max current=1A; PartGroup: Inductors,EMI; Manufacturer: Murata; TemperatureRange: -55; AN: A03-0035; Height: 0,800000011920929; MPN: BLM18PG471SN1
Q400 = A05-0051: Dual N-Channel MOSFET, 60V, 115mA cont,RDS(ON) < 7.5 Ohm @50mA@5V, SOT-363; PartGroup: Transistors,Small signal FET,SMD; Manufacturer: Fairchild; TemperatureRange: -65 to 150 deg C; AN: A05-0051; Height: 1,10000002384186; MPN: 2N7002DW
R401 R409 R411 R412 = A02-0212: as R301 on sheet Tiny817_Xplained_Pro_Target_MCU; AN: A02-0212; Tolerance: 1 %; Height: 0,349999994039536
R404 R406-R408 R415 R425 R426 = A02-0163: as R307 on sheet Tiny817_Xplained_Pro_Target_MCU; AN: A02-0163; Height: 0,349999994039536
R410 R413 R424 = A02-0284: Thick film resistor, SMD 0402, 1/16W, 1%; PartGroup: Resistors,SMD,0402 1%; Manufacturer: ASJ; MPN: CR10-1004-FK; TemperatureRange: -55 - +125 deg C; AN: A02-0284; Tolerance: 1 %; Height: 0,349999994039536
R414 R416 R417 R420 = A02-0200: Thick film resistor, SMD 0402, 1/16W, 1%; PartGroup: Resistors,SMD,0402 1%; Manufacturer: ASJ; MPN: CR10-3300-FK; TemperatureRange: -55 - +125 deg C; AN: A02-0200; Tolerance: 1 %; Height: 0,349999994039536
R421 R422 = A02-0178: as R300 on sheet Tiny817_Xplained_Pro_Target_MCU; AN: A02-0178; Tolerance: 1 %; Height: 0,349999994039536
R423 = A02-0539: Thick film resistor, SMD 0402, 1/16W, 1%; PartGroup: Resistors,SMD,0402 1%; Manufacturer: vishay; MPN: CRCW04026K81FKED; TemperatureRange: -55 - +125 deg C; AN: A02-0539; Tolerance: 1%; Height: 0,349999994039536
TP400-TP407 = A08-0004: as TP300 on sheet Tiny817_Xplained_Pro_Target_MCU; AN: A08-0004; Value: TESTPAD; Height: 0
U400 = A06-0736: AVR 32-bit RISC MCU; PartGroup: Integrated Circuits,MCU, MPU, DSP,AVR MCU; Manufacturer: ATMEL; TemperatureRange: -40 to +85 deg C; AN: A06-0736; Height: 1; MPN: AT32UC3A4256J-C1UR
XC400 = A07-0128: Kyocera CX3225GB12000H0KPSC1, 12MHz, 12pF, SMD crystal; PartGroup: Frequency devices,Crystals,SMD; Manufacturer: Kyocera Crystal Device Corporation; Tolerance: Â±30ppm; TemperatureRange: -40Â°C to +85Â°C; AN: A07-0128; Height: 0,800000011920929; MPN: CX3225GB12000H0KPSC1

## Sheet Tiny817_Xplained_Pro_Connectors.SchDoc: Extension connectors
size A3; Organization: ATMEL Norway; Address1: Vestre Rosten 79; Address2: N-7075 TILLER; Address3: NORWAY; DocumentNumber: A09-2654; Revision: 4; SheetNumber: 3; SheetTotal: 9; PageSetup: Record=PageOptions|CenterHorizontal=True|CenterVertical=True|PrintScale=1.01|XCorrection=1.00|YCorrection=1.00|PrintKind=1|BorderSize=5000000|LeftOffset=0|BottomOffset=0|Orientation=2|PaperLength=1000|PaperWidth=1000|Scale=100|PaperSource=7|PrintQuality=-4|MediaType=1|DitherType=10|PaperKind=A3 (297 x 420 mm)|PrintScaleMode=1
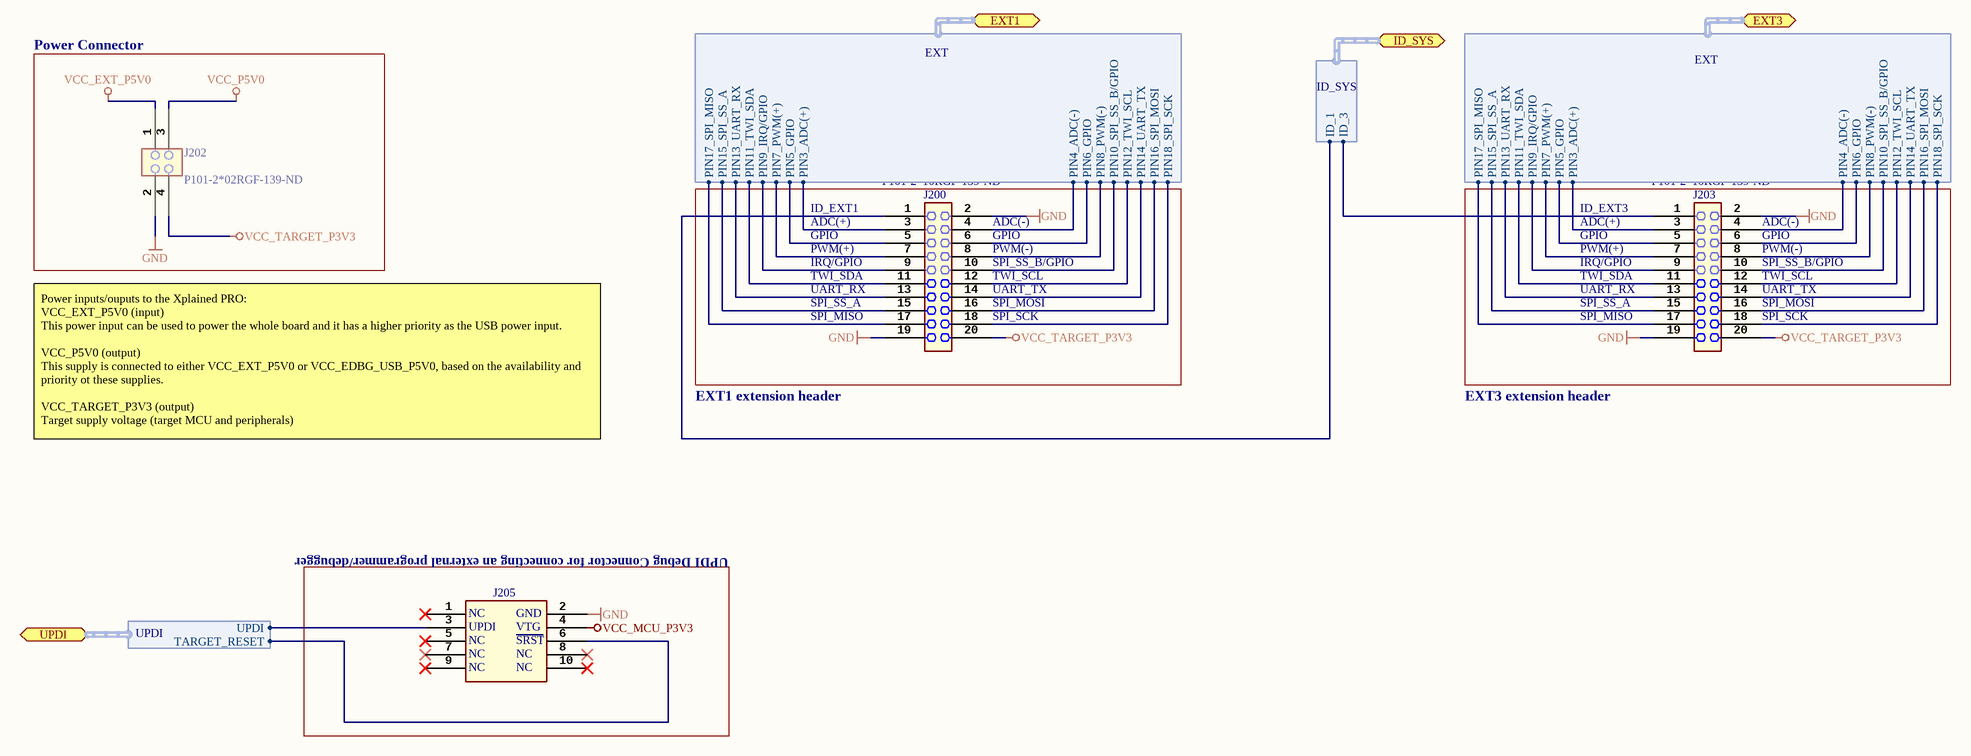
[diagram p3: Tiny817_Xplained_Pro_Connectors.SchDoc]

### Parts
J200  value P101-2*10RGF-139-ND  [AP8-00622]
J202  value P101-2*02RGF-139-ND  [AP8-00628]
J203  value P101-2*10RGF-139-ND  [AP8-00622]
J205  (no value)  [AP8-00257]

### Blocks framed on the sheet
Power Connector: J202

### Ports
EXT1 (harness EXT), EXT3 (harness EXT), ID_SYS (harness ID_SYS), UPDI (harness UPDI)

### Harnesses
ID_SYS: ID_1, ID_3
EXT: PIN3_ADC(+), PIN4_ADC(-), PIN5_GPIO, PIN6_GPIO, PIN7_PWM(+), PIN8_PWM(-), PIN9_IRQ/GPIO, PIN10_SPI_SS_B/GPIO, PIN11_TWI_SDA, PIN12_TWI_SCL, PIN13_UART_RX, PIN14_UART_TX, PIN15_SPI_SS_A, PIN16_SPI_MOSI, PIN17_SPI_MISO, PIN18_SPI_SCK
UPDI: TARGET_RESET, UPDI

### Nets
GND: J200.2 J200.19 J202.2 J203.2 J203.19 J205.2
VCC_EXT_P5V0: J202.1
VCC_MCU_P3V3: J205.4
VCC_P5V0: J202.3
VCC_TARGET_P3V3: J200.20 J202.4 J203.20
ID1: J200.1 ; port ID_SYS.ID_1
ID3: J203.1 ; port ID_SYS.ID_3
PA0_UPDI_RST: J205.3 ; port UPDI.UPDI
PA1_I2C_SDA: J200.11 J203.11 ; port EXT1.PIN11_TWI_SDA, port EXT3.PIN11_TWI_SDA
PA2_I2C_SCL: J200.12 J203.12 ; port EXT1.PIN12_TWI_SCL, port EXT3.PIN12_TWI_SCL
PA3_GPIO_SS: J203.15 ; port EXT3.PIN15_SPI_SS_A
PA4_GPIO: J200.10 ; port EXT1.PIN10_SPI_SS_B/GPIO
PA5_IRQ_GPIO: J200.9 ; port EXT1.PIN9_IRQ/GPIO
PA6_AIN6: J200.3 ; port EXT1.PIN3_ADC(+)
PA7_AIN7: J200.4 ; port EXT1.PIN4_ADC(-)
PB0_PWM_W0: J200.7 ; port EXT1.PIN7_PWM(+)
PB1_PWM_W1: J200.8 ; port EXT1.PIN8_PWM(-)
PB2_UART_TXD: J200.14 J203.14 ; port EXT1.PIN14_UART_TX, port EXT3.PIN14_UART_TX
PB3_UART_RXD: J200.13 J203.13 ; port EXT1.PIN13_UART_RX, port EXT3.PIN13_UART_RX
PB4_GPIO2: J200.6 ; port EXT1.PIN6_GPIO
PB5_GPIO: J203.10 ; port EXT3.PIN10_SPI_SS_B/GPIO
PB6_IRQ_GPIO: J203.9 ; port EXT3.PIN9_IRQ/GPIO
PB7_GPIO1: J200.5 ; port EXT1.PIN5_GPIO
PC0_SPI_SCK: J200.18 J203.18 ; port EXT1.PIN18_SPI_SCK, port EXT3.PIN18_SPI_SCK
PC1_SPI_MISO: J200.17 J203.17 ; port EXT1.PIN17_SPI_MISO, port EXT3.PIN17_SPI_MISO
PC2_SPI_MOSI: J200.16 J203.16 ; port EXT1.PIN16_SPI_MOSI, port EXT3.PIN16_SPI_MOSI
PC3_SPI_SS: J200.15 ; port EXT1.PIN15_SPI_SS_A
PC5_GPIO: J203.5 J205.6 ; port EXT3.PIN5_GPIO, port UPDI.TARGET_RESET
NetJ203_3: J203.3 ; port EXT3.PIN3_ADC(+)
NetJ203_4: J203.4 ; port EXT3.PIN4_ADC(-)
NetJ203_6: J203.6 ; port EXT3.PIN6_GPIO
NetJ203_7: J203.7 ; port EXT3.PIN7_PWM(+)
NetJ203_8: J203.8 ; port EXT3.PIN8_PWM(-)

Not connected (* = marked no-connect by the designer): J205 1* 5* 7* 8* 9* 10*

### Notes on the sheet
- ID_EXT1
- ID_EXT3
- ADC(+)
- GPIO
- PWM(+)
- IRQ/GPIO
- TWI_SDA
- UART_RX
- (near J200) ADC(-)
- (near J200) GPIO
- (near J200) PWM(-)
- (near J200) SPI_SS_B/GPIO
- (near J200) TWI_SCL
- (near J200) UART_TX
- (near J203) ADC(-)
- (near J203) GPIO
- (near J203) PWM(-)
- (near J203) SPI_SS_B/GPIO
- (near J203) TWI_SCL
- (near J203) UART_TX
- SPI_SS_A
- SPI_MISO
- (near J200) SPI_MOSI
- (near J200) SPI_SCK
- (near J203) SPI_MOSI
- (near J203) SPI_SCK
- EXT1 extension header
- EXT3 extension header
- Power inputs/ouputs to the Xplained PRO:
  VCC_EXT_P5V0 (input)
  This power input can be used to power the whole board and it has a higher priority as the USB power input.
  VCC_P5V0 (output)
  This supply is connected to either VCC_EXT_P5V0 or VCC_EDBG_USB_P5V0, based on the availability and priority ot these supplies.
  VCC_TARGET_P3V3 (output)
  Target supply voltage (target MCU and peripherals)
- (near J205) UPDI Debug Connector for connecting an external programmer/debugger
- Date:
- PAGE:
- of
- TITLE:
- Document number:
- Revision:
- (in symbol A08-0385) NC; GND; UPDI; VTG; SRST

### Library data of the parts
J200 J203 = A08-1513: Pin header, 2x10, Right Angle, 2.54mm, THM, Pin In Paste; PartGroup: Mechanical devices,Connectors,Pin headers; Manufacturer: Pro-data International Corp; AN: A08-1513; MPN: P101-2*10RGF-139-ND
J202 = A08-1519: Pin header, 2x2, Right Angle, 2.54mm, THT, Pin In Paste; PartGroup: Mechanical devices,Connectors,Pin headers; Manufacturer: Pro-data International Corp; AN: A08-1519; Height: 5,07999992370605; MPN: P101-2*02RGF-139-ND
J205 = A08-0385: 2x5 pin header, 1.27mm pitch, THM; PartGroup: Mechanical devices,Connectors,Pin headers; Manufacturer: Garry; MPN: 176-2-010-0-T-XS0-0730; Value: PIN HEADER 2x5; AN: A08-0385; Height: 7,30000019073486

## Sheet Tiny817_Xplained_Pro_dual_input_power_supply.SchDoc: Power supply
size A3; Organization: ATMEL Norway; Address1: Vestre Rosten 79; Address2: N-7075 TILLER; Address3: NORWAY; DocumentNumber: A09-2654; Revision: 4; SheetNumber: 4; SheetTotal: 9; PageSetup: Record=PageOptions|CenterHorizontal=True|CenterVertical=True|PrintScale=1.01|XCorrection=1.00|YCorrection=1.00|PrintKind=1|BorderSize=5000000|LeftOffset=0|BottomOffset=0|Orientation=2|PaperLength=1000|PaperWidth=1000|Scale=100|PaperSource=7|PrintQuality=-4|MediaType=1|DitherType=10|PaperKind=A3 (297 x 420 mm)|PrintScaleMode=1
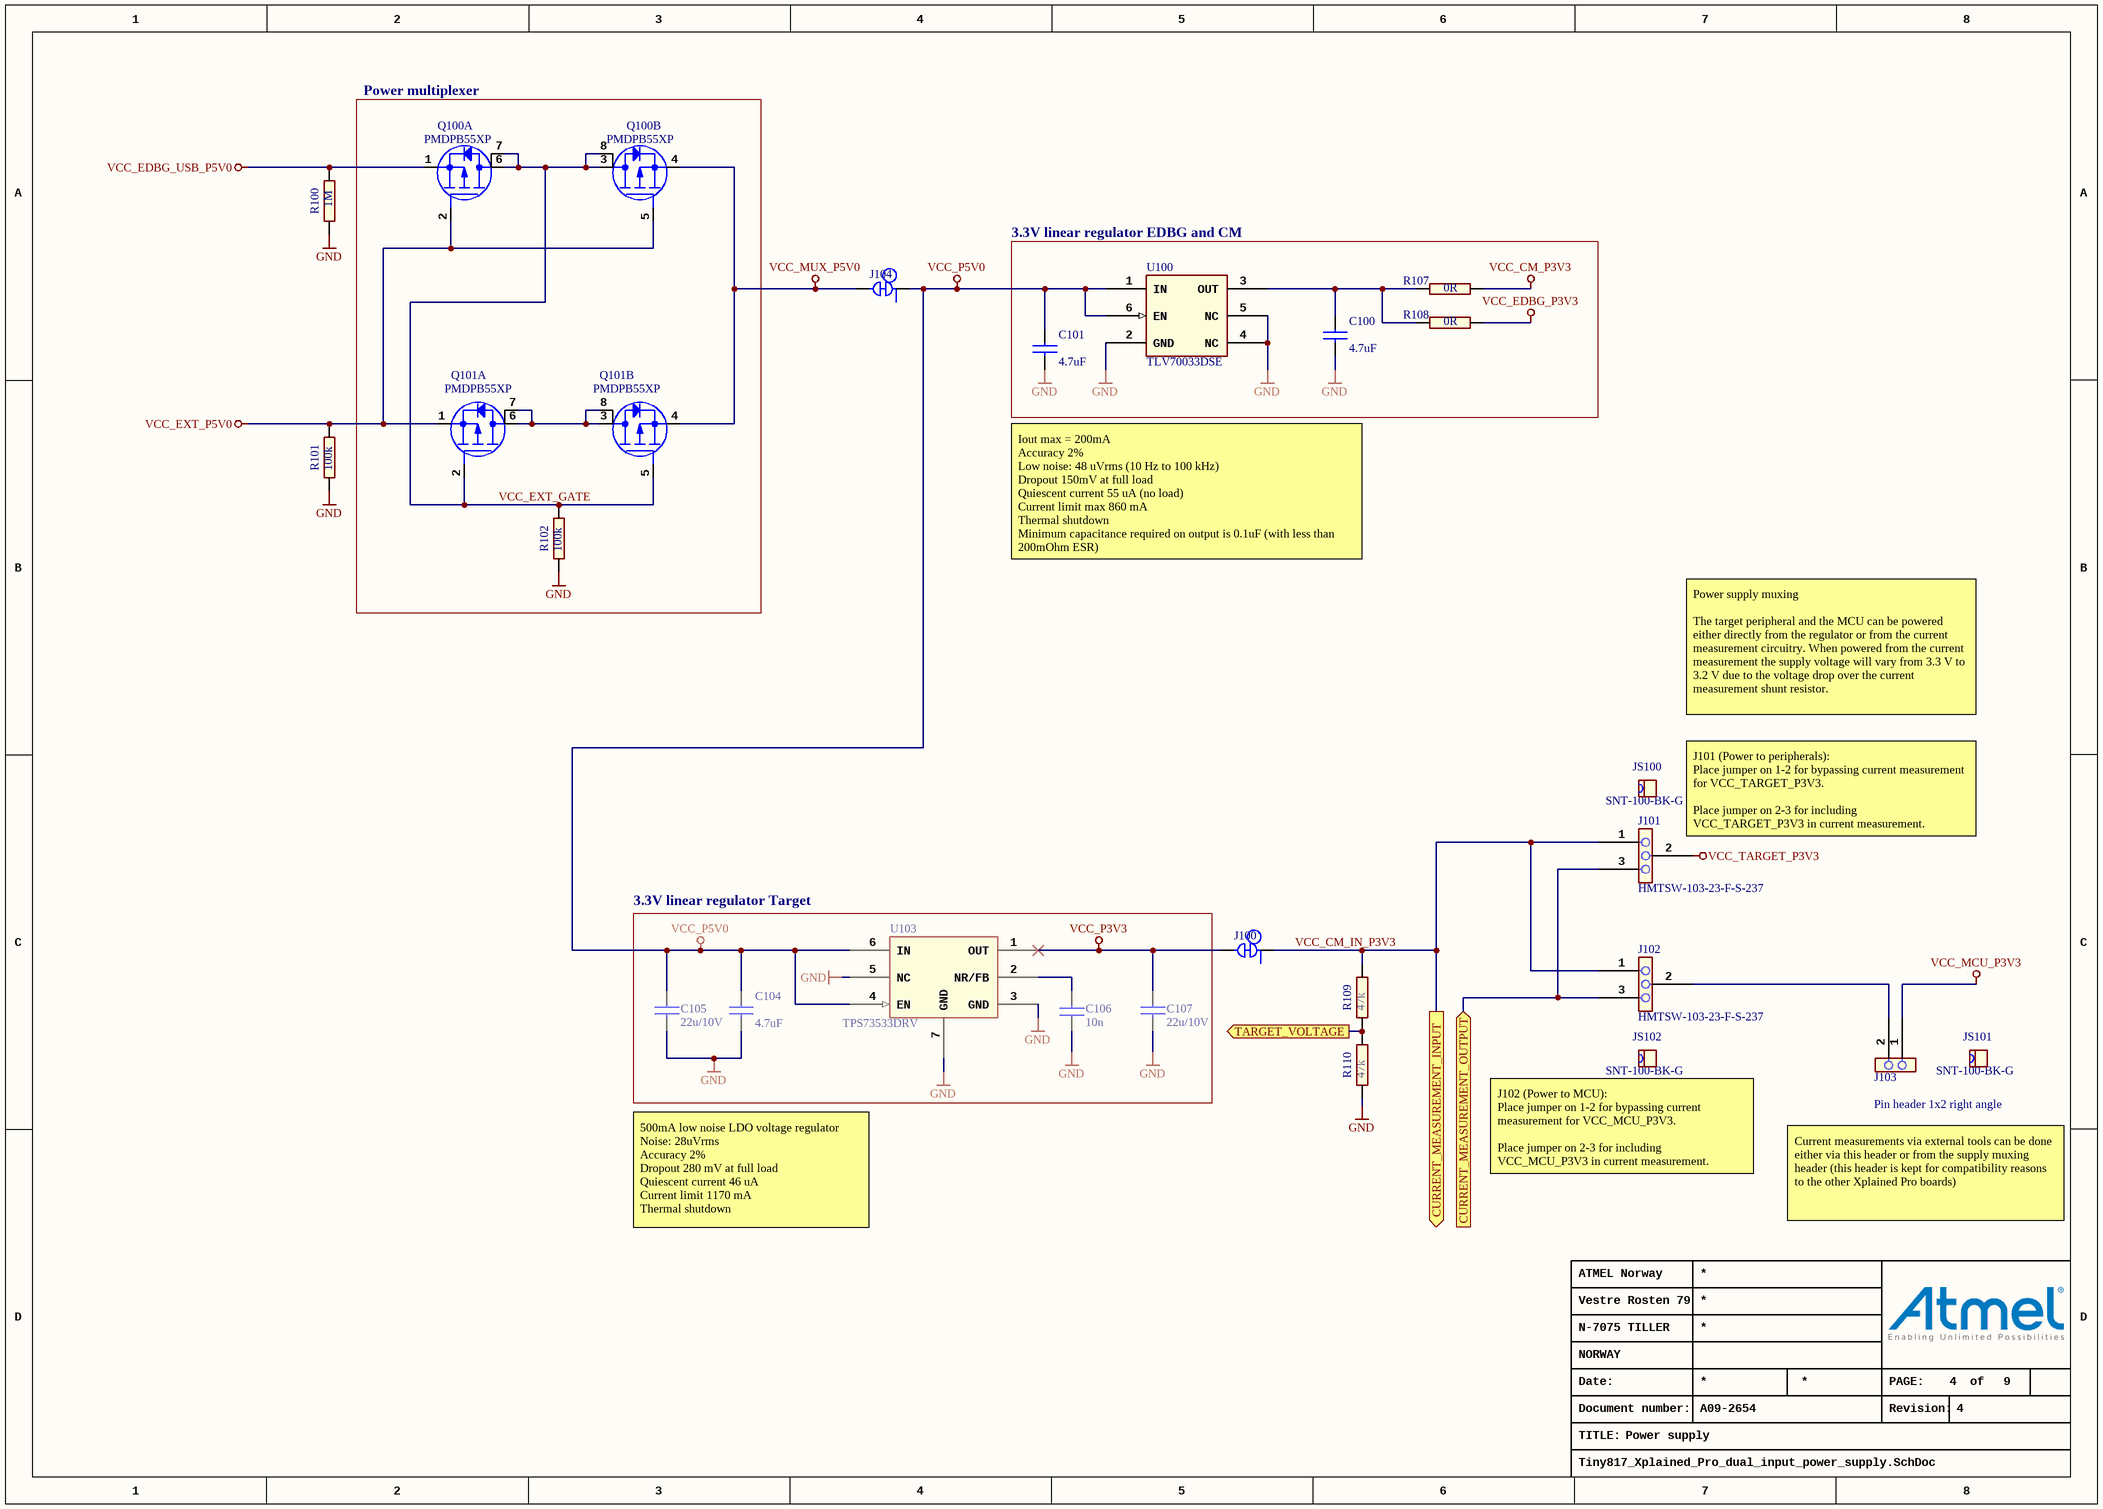
[diagram p4: Tiny817_Xplained_Pro_dual_input_power_supply.SchDoc]

### Parts
C100  value 4.7uF  [AP1-00117]
C101  value 4.7uF  [AP1-00117]
C104  value 4.7uF  [AP1-00117]
C105  value 22u/10V  [AP1-00003]
C106  value 10n  [AP1-00053]
C107  value 22u/10V  [AP1-00003]
J100  (no value)  [AP9-00044]  (net tie, no BOM)
J101  value HMTSW-103-23-F-S-237  [AP8-00745]
J102  value HMTSW-103-23-F-S-237  [AP8-00745]
J103  value Pin header 1x2 right angle  [AP8-00367]
J104  (no value)  [AP9-00044]  (net tie, no BOM)
JS100  value SNT-100-BK-G  [AP8-00525]
JS101  value SNT-100-BK-G  [AP8-00525]
JS102  value SNT-100-BK-G  [AP8-00525]
Q100  value PMDPB55XP  [AP5-00047]  (hidden comment: Farnell order code: 2191806)  (parts A,B of 2)
Q101  value PMDPB55XP  [AP5-00047]  (hidden comment: Farnell order code: 2191806)  (parts A,B of 2)
R100  value 1M  [AP2-00011]
R101  value 100k  [AP2-00011]
R102  value 100k  [AP2-00011]
R107  value 0R  [AP2-00011]
R108  value 0R  [AP2-00011]
R109  value 47k  [AP2-00011]
R110  value 47k  [AP2-00011]
U100  value TLV70033DSE  [AP6-00262]
U103  value TPS73533DRV  [AP6-00162]

### Blocks framed on the sheet
Power multiplexer: Q100 Q101 R102
3.3V linear regulator EDBG and CM: C100 C101 R107 R108 U100
3.3V linear regulator Target: C104-C107 U103

### Ports
CURRENT_MEASUREMENT_INPUT (out), CURRENT_MEASUREMENT_OUTPUT (in), TARGET_VOLTAGE (out)

### Nets
GND: C100.2 C101.2 C104.2 C105.2 C106.1 C107.2 R100.1 R101.1 R102.1 R110.1 U100.2(GND) U100.4(NC) U100.5(NC) U103.3(GND) U103.5(NC) U103.7(GND)
VCC_CM_P3V3: R107.1
VCC_EDBG_P3V3: R108.1
VCC_EDBG_USB_P5V0: Q100.1(S1) R100.2
VCC_EXT_P5V0: Q100.2(G1) Q100.5(G2) Q101.1(S1) R101.2
VCC_MCU_P3V3: J103.1
VCC_MUX_P5V0: J104.2 Q100.4(S2) Q101.4(S2)
VCC_P3V3: C107.1 J100.2 U103.1(OUT)
VCC_P5V0: C101.1 C104.1 C105.1 J104.1 U100.1(IN) U100.6(EN) U103.4(EN) U103.6(IN)
VCC_TARGET_P3V3: J101.2
CM_PA09_AIN17: R109.1 R110.2 ; port TARGET_VOLTAGE
VCC_CM_IN_P3V3: J100.1 J101.1 J102.1 R109.2 ; port CURRENT_MEASUREMENT_INPUT
VCC_EXT_GATE: Q100.3(D2) Q100.6(D1) Q100.7(D1_PAD) Q100.8(D2_PAD) Q101.2(G1) Q101.5(G2) R102.2
NetC100_1: C100.1 R107.2 R108.2 U100.3(OUT)
NetC106_2: C106.2 U103.2(NR/FB)
NetJ101_3: J101.3 J102.3 ; port CURRENT_MEASUREMENT_OUTPUT
NetJ102_2: J102.2 J103.2
NetQ101_3: Q101.3(D2) Q101.6(D1) Q101.7(D1_PAD) Q101.8(D2_PAD)

### Notes on the sheet
- Iout max = 200mA
  Accuracy 2%
  Low noise: 48 uVrms (10 Hz to 100 kHz)
  Dropout 150mV at full load
  Quiescent current 55 uA (no load)
  Current limit max 860 mA
  Thermal shutdown
  Minimum capacitance required on output is 0.1uF (with less than 200mOhm ESR)
- Power supply muxing
  The target peripheral and the MCU can be powered either directly from the regulator or from the current measurement circuitry. When powered from the current measurement the supply voltage will vary from 3.3 V to 3.2 V due to the voltage drop over the current measurement shunt resistor.
- J101 (Power to peripherals):
  Place jumper on 1-2 for bypassing current measurement for VCC_TARGET_P3V3.
  Place jumper on 2-3 for including VCC_TARGET_P3V3 in current measurement.
- (near JS102) J102 (Power to MCU):
  Place jumper on 1-2 for bypassing current measurement for VCC_MCU_P3V3.
  Place jumper on 2-3 for including VCC_MCU_P3V3 in current measurement.
- 500mA low noise LDO voltage regulator
  Noise: 28uVrms
  Accuracy 2%
  Dropout 280 mV at full load
  Quiescent current 46 uA
  Current limit 1170 mA
  Thermal shutdown
- Current measurements via external tools can be done either via this header or from the supply muxing header (this header is kept for compatibility reasons to the other Xplained Pro boards)
- Date:
- PAGE:
- of
- TITLE:
- Document number:
- Revision:

### Library data of the parts
C100 C101 C104 = A01-0377: as C305 on sheet Tiny817_Xplained_Pro_Target_MCU; AN: A01-0377; Tolerance: 10%; Height: 0,800000011920929
C105 C107 = A01-0500: Ceramic capacitor, SMD 0805, X5R, 10V, Â±20%; PartGroup: Capacitors,Ceramic,SMD 0805; Manufacturer: tdk; MPN: C2012X5R1A226M/0.85; TemperatureRange: -55Â°C to +85Â°C; AN: A01-0500; Height: 0,949999988079071
C106 = A01-0050: Ceramic capacitor, SMD 0402, X7R, 25V, +/-10%; PartGroup: Capacitors,Ceramic,SMD 0402; Manufacturer: YAGEO CORP; MPN: CC0402KRX7R8BB103; TemperatureRange: -55 - +125 deg C; AN: A01-0050; Tolerance: 25V, +/-10%; Height: 0,550000011920929
J100 J104 = A09-0783: as J305 on sheet Tiny817_Xplained_Pro_Target_MCU; AN: A09-0783; Height: 0
J101 J102 = A08-1799: 1x3 pin header, 2.54mm pitch, Pin-in-Paste THM, 1mm hole; PartGroup: Mechanical devices,Connectors,Pin headers; Manufacturer: SAMTEC; AN: A08-1799; Height: 6,09999990463257; MPN: HMTSW-103-23-F-S-237
J103 = A08-0764: 1x2 pin header, right angle, 2.54 mm pitch, through-hole; PartGroup: Mechanical devices,Connectors,Pin headers; Manufacturer: Pro-data International Corp; MPN: 2213R-2G; AN: A08-0764; Height: 2,53999996185303
JS100-JS102 = A08-0543: Jumper cap for 2.54mm pinheader; PartGroup: Mechanical devices,Mounting accessories,Other; Manufacturer: SAMTEC; AN: A08-0543; MPN: SNT-100-BK-G
Q100 Q101 = A05-0146: Dual P-Channel MOSFET, -20V, RDS(ON) < 55 mOhm @-3.4A@-4.5V; PartGroup: Transistors,Power FET,SMD; Manufacturer: NXP; TemperatureRange: -55Â°C to 150Â°C; AN: A05-0146; Height: 0,649999976158142; MPN: PMDPB55XP
R100 = A02-0284: as R410 on sheet Tiny817_Xplained_Pro_EDBG; AN: A02-0284; Tolerance: 1 %; Height: 0,349999994039536
R101 R102 = A02-0260: as R304 on sheet Tiny817_Xplained_Pro_Target_MCU; AN: A02-0260; Tolerance: 1 %; Height: 0,349999994039536
R107 R108 = A02-0163: as R307 on sheet Tiny817_Xplained_Pro_Target_MCU; AN: A02-0163; Height: 0,349999994039536
R109 R110 = A02-0252: Thick film resistor, SMD 0402, 1/16W, 1%; PartGroup: Resistors,SMD,0402 1%; Manufacturer: KOA; MPN: RK73H1ETTP4702F; TemperatureRange: -55 - +125 deg C; AN: A02-0252; Tolerance: 1 %; Height: 0,349999994039536
U100 = A06-0719: LDO, 200 mA, Iq=31 uA, Vdo=250mV, Vout=3.3V, VIN= 2 V to 5.5V, SON-6 package; PartGroup: Integrated Circuits,Regulators,Linear; Manufacturer: Texas Instruments; AN: A06-0719; Height: 0,800000011920929; MPN: TLV70033DSE
U103 = A06-1135: Low noise LDO, 500 mA, Vout=3.3V, 2% accuracy, IQ=46uA, noise=28uVrms, VIN= 2.7V to 6.5V, Vdo=280mV,stable with low ESR capacitor; PartGroup: Integrated Circuits,Regulators,Linear; Manufacturer: Texas Instruments; AN: A06-1135; Height: 0,75; MPN: TPS73533DRV

## Sheet Tiny817_Xplained_Pro_current_measurement.SchDoc: Current measurement
size A3; Organization: ATMEL Norway; Address1: Vestre Rosten 79; Address2: N-7075 TILLER; Address3: NORWAY; DocumentNumber: A09-2654; Revision: 4; SheetNumber: 5; SheetTotal: 9; PageSetup: Record=PageOptions|CenterHorizontal=True|CenterVertical=True|PrintScale=1.01|XCorrection=1.00|YCorrection=1.00|PrintKind=1|BorderSize=5000000|LeftOffset=0|BottomOffset=0|Orientation=2|PaperLength=1000|PaperWidth=1000|Scale=100|PaperSource=7|PrintQuality=-4|MediaType=1|DitherType=10|PaperKind=A3 (297 x 420 mm)|PrintScaleMode=1
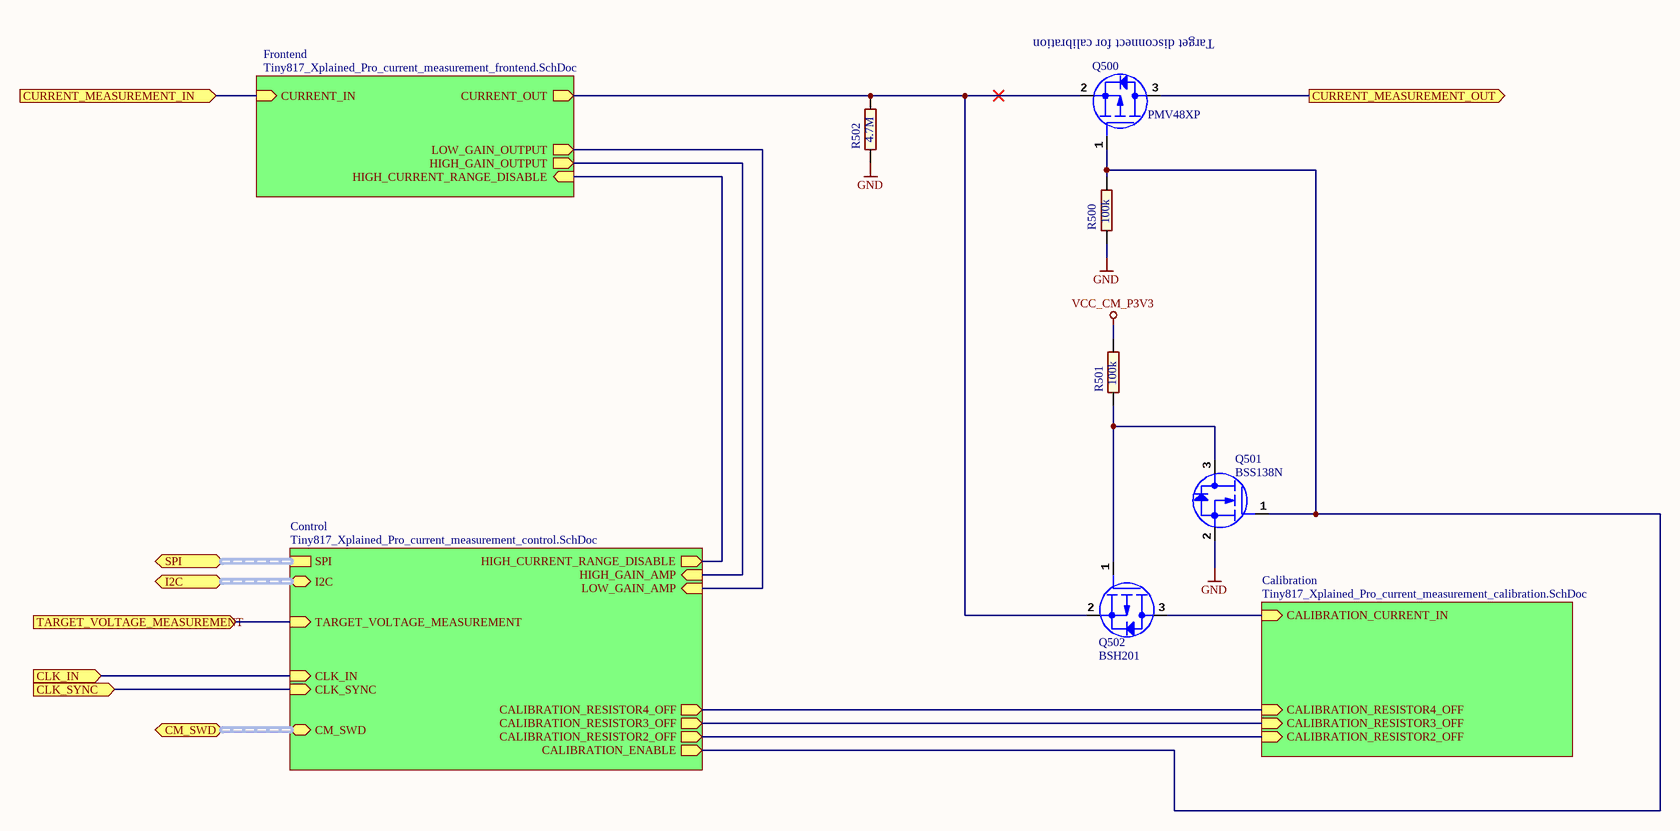
[diagram p5: Tiny817_Xplained_Pro_current_measurement.SchDoc]

### Parts
Q500  value PMV48XP  [AP5-00002]
Q501  value BSS138N  [AP5-00002]
Q502  value BSH201  [AP5-00002]
R500  value 100k  [AP2-00011]
R501  value 100k  [AP2-00011]
R502  value 4.7M  [AP2-00011]

### Sub-sheets
Calibration = Tiny817_Xplained_Pro_current_measurement_calibration.SchDoc: CALIBRATION_RESISTOR2_OFF (in), CALIBRATION_RESISTOR3_OFF (in), CALIBRATION_RESISTOR4_OFF (in), CALIBRATION_CURRENT_IN (in)
Control = Tiny817_Xplained_Pro_current_measurement_control.SchDoc: LOW_GAIN_AMP (in), HIGH_GAIN_AMP (in), HIGH_CURRENT_RANGE_DISABLE (out), SPI (harness SPI), CALIBRATION_RESISTOR3_OFF (out), CALIBRATION_RESISTOR2_OFF (out), CALIBRATION_ENABLE (out), CALIBRATION_RESISTOR4_OFF (out), I2C (harness I2C), CLK_IN (in), CLK_SYNC (in), TARGET_VOLTAGE_MEASUREMENT (in), CM_SWD (harness SWD)
Frontend = Tiny817_Xplained_Pro_current_measurement_frontend.SchDoc: CURRENT_OUT (out), CURRENT_IN (in), LOW_GAIN_OUTPUT (out), HIGH_GAIN_OUTPUT (out), HIGH_CURRENT_RANGE_DISABLE (in)

### Ports
CLK_IN (in), CLK_SYNC (in), CM_SWD (harness SWD), CURRENT_MEASUREMENT_IN (in), CURRENT_MEASUREMENT_OUT (out), I2C (harness I2C), SPI (harness SPI), TARGET_VOLTAGE_MEASUREMENT (in)

### Nets
GND: Q501.2(S) R500.1 R502.1
VCC_CM_P3V3: R501.2
CM_PA00_GPIO: sheet Calibration/CALIBRATION_RESISTOR3_OFF, sheet Control/CALIBRATION_RESISTOR3_OFF
CM_PA01_GPIO: sheet Calibration/CALIBRATION_RESISTOR4_OFF, sheet Control/CALIBRATION_RESISTOR4_OFF
CM_PA05_AIN5: sheet Control/LOW_GAIN_AMP, sheet Frontend/LOW_GAIN_OUTPUT
CM_PA08_AIN16: sheet Control/HIGH_GAIN_AMP, sheet Frontend/HIGH_GAIN_OUTPUT
CM_PA09_AIN17: port TARGET_VOLTAGE_MEASUREMENT, sheet Control/TARGET_VOLTAGE_MEASUREMENT
CM_PA10_GPIO: Q500.1(G) Q501.1(G) R500.2 ; sheet Control/CALIBRATION_ENABLE
CM_PA11_GCLK5: port CLK_SYNC, sheet Control/CLK_SYNC
CM_PA14_GCLK0: port CLK_IN, sheet Control/CLK_IN
CM_PA15_GPIO: sheet Calibration/CALIBRATION_RESISTOR2_OFF, sheet Control/CALIBRATION_RESISTOR2_OFF
CM_PA18_CMP0: sheet Control/HIGH_CURRENT_RANGE_DISABLE, sheet Frontend/HIGH_CURRENT_RANGE_DISABLE
VCC_CM_IN_P3V3: port CURRENT_MEASUREMENT_IN, sheet Frontend/CURRENT_IN
NetJ101_3: Q500.3(D) ; port CURRENT_MEASUREMENT_OUT
NetQ500_2: Q500.2(S) Q502.2(S) R502.2 ; sheet Frontend/CURRENT_OUT
NetQ501_3: Q501.3(D) Q502.1(G) R501.1
NetQ502_3: Q502.3(D) ; sheet Calibration/CALIBRATION_CURRENT_IN

### Buses and harness runs
harness port CM_SWD = sheet Control/CM_SWD
harness port I2C = sheet Control/I2C
harness port SPI = sheet Control/SPI

### Notes on the sheet
- (near Q500) Target disconnect for calibration
- Date:
- PAGE:
- of
- TITLE:
- Document number:
- Revision:

### Library data of the parts
Q500 = A05-0130: P-Channel Digital FET. -30V, -3.5A continuous, -14A Peak. RDS(ON)=48mOhm@VGS=-4.5V, RDS(ON)=71mOhm@VGS=-2.5V. VGS(th)<1.25V; PartGroup: Transistors,Power FET,SMD; Manufacturer: NXP; MPN: PMV48XP,215; TemperatureRange: -55Â°C to +150Â°C; AN: A05-0130
Q501 = A05-0140: Low leakage N-Channel MOSFET. 60V, 0.23A continuous, 0.92A Peak. RDS(ON) = 3.5Ohm@VGS=4.5V, VGS(th)<1.4V; PartGroup: Transistors,Small signal FET,SMD; Manufacturer: Infineon; TemperatureRange: -55  to +150 deg celcius; AN: A05-0140; Height: 1,10000002384186; MPN: BSS138N
Q502 = A05-0132: P-Channel Digital FET. -60V, -0.3A continuous, -1.2A Peak. RDS(ON)=2.5@VGS=-10V, RDS(ON)=<5 ohm @VGS=-2.5V. VGS(th)<1.9V; PartGroup: Transistors,Small signal FET,SMD; Manufacturer: NXP; MPN: BSH201,215; AN: A05-0132
R500 R501 = A02-0260: as R304 on sheet Tiny817_Xplained_Pro_Target_MCU; AN: A02-0260; Tolerance: 1 %; Height: 0,349999994039536
R502 = A02-0884: Thick film SMD 0402 1/16W 1%; PartGroup: Resistors,SMD,0402 1%; Manufacturer: YAGEO CORP; MPN: RC0402FR-074M7L; TemperatureRange: -55 Â°C to +155 Â°C; AN: A02-0884; Tolerance: 1 %

## Sheet Tiny817_Xplained_Pro_current_measurement_calibration.SchDoc: Current measurement calibration
size A3; Organization: ATMEL Norway; Address1: Vestre Rosten 79; Address2: N-7075 TILLER; Address3: NORWAY; DocumentNumber: A09-2654; Revision: 4; SheetNumber: 8; SheetTotal: 9; PageSetup: Record=PageOptions|CenterHorizontal=True|CenterVertical=True|PrintScale=1.01|XCorrection=1.00|YCorrection=1.00|PrintKind=1|BorderSize=5000000|LeftOffset=0|BottomOffset=0|Orientation=2|PaperLength=1000|PaperWidth=1000|Scale=100|PaperSource=7|PrintQuality=-4|MediaType=1|DitherType=10|PaperKind=A3 (297 x 420 mm)|PrintScaleMode=1
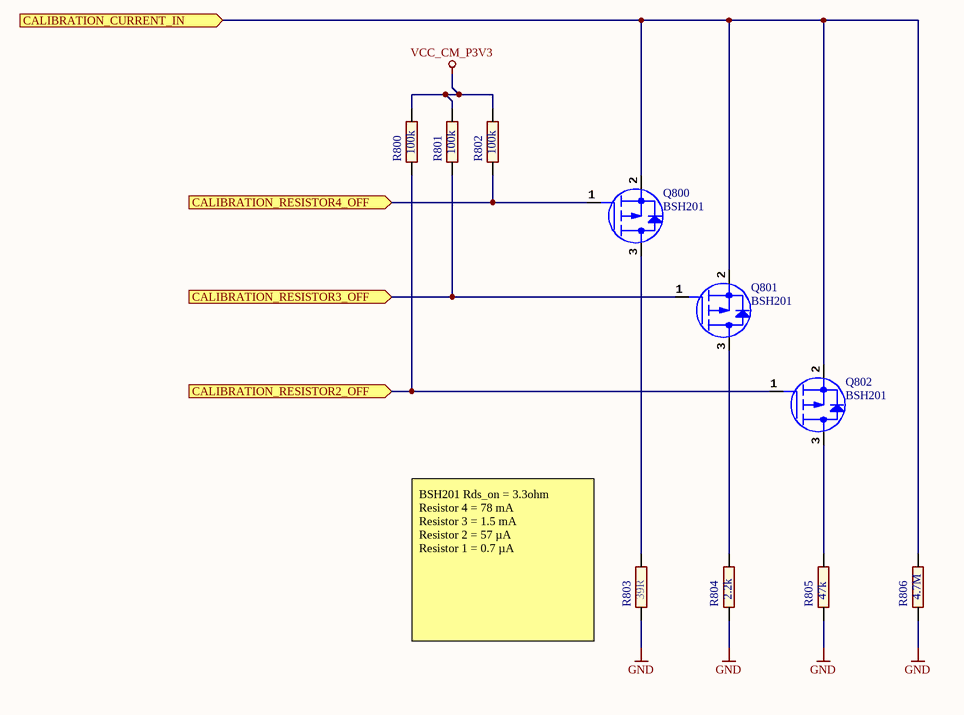
[diagram p6: Tiny817_Xplained_Pro_current_measurement_calibration.SchDoc]

### Parts
Q800  value BSH201  [AP5-00002]
Q801  value BSH201  [AP5-00002]
Q802  value BSH201  [AP5-00002]
R800  value 100k  [AP2-00011]
R801  value 100k  [AP2-00011]
R802  value 100k  [AP2-00011]
R803  value 39R  [AP2-00011]
R804  value 2.2k  [AP2-00011]
R805  value 47k  [AP2-00011]
R806  value 4.7M  [AP2-00011]

### Ports
CALIBRATION_CURRENT_IN (in), CALIBRATION_RESISTOR2_OFF (in), CALIBRATION_RESISTOR3_OFF (in), CALIBRATION_RESISTOR4_OFF (in)

### Nets
GND: R803.1 R804.1 R805.1 R806.1
VCC_CM_P3V3: R800.2 R801.2 R802.2
CM_PA00_GPIO: Q801.1(G) R801.1 ; port CALIBRATION_RESISTOR3_OFF
CM_PA01_GPIO: Q800.1(G) R802.1 ; port CALIBRATION_RESISTOR4_OFF
CM_PA15_GPIO: Q802.1(G) R800.1 ; port CALIBRATION_RESISTOR2_OFF
NetQ502_3: Q800.2(S) Q801.2(S) Q802.2(S) R806.2 ; port CALIBRATION_CURRENT_IN
NetQ800_3: Q800.3(D) R803.2
NetQ801_3: Q801.3(D) R804.2
NetQ802_3: Q802.3(D) R805.2

### Notes on the sheet
- (near R803) BSH201 Rds_on = 3.3ohm
  Resistor 4 = 78 mA
  Resistor 3 = 1.5 mA
  Resistor 2 = 57 µA
  Resistor 1 = 0.7 µA
- Date:
- PAGE:
- of
- TITLE:
- Document number:
- Revision:

### Library data of the parts
Q800-Q802 = A05-0132: as Q502 on sheet Tiny817_Xplained_Pro_current_measurement; AN: A05-0132
R800-R802 = A02-0260: as R304 on sheet Tiny817_Xplained_Pro_Target_MCU; AN: A02-0260; Tolerance: 1 %; Height: 0,349999994039536
R803 = A02-0178: as R300 on sheet Tiny817_Xplained_Pro_Target_MCU; AN: A02-0178; Tolerance: 1 %; Height: 0,349999994039536
R804 = A02-0220: Thick film resistor, SMD 0402, 1/16W, 1%; PartGroup: Resistors,SMD,0402 1%; Manufacturer: ASJ; MPN: CR10-2201-FK; TemperatureRange: -55 - +125 deg C; AN: A02-0220; Tolerance: 1 %; Height: 0,349999994039536
R805 = A02-0252: as R109 on sheet Tiny817_Xplained_Pro_dual_input_power_supply; AN: A02-0252; Tolerance: 1 %; Height: 0,349999994039536
R806 = A02-0884: as R502 on sheet Tiny817_Xplained_Pro_current_measurement; AN: A02-0884; Tolerance: 1 %